# EAGLE schematic Maker Display4 (EAGLE 7.3.0), part 1 of 2

## Sheet 1 of 9: Matrix Driver 1
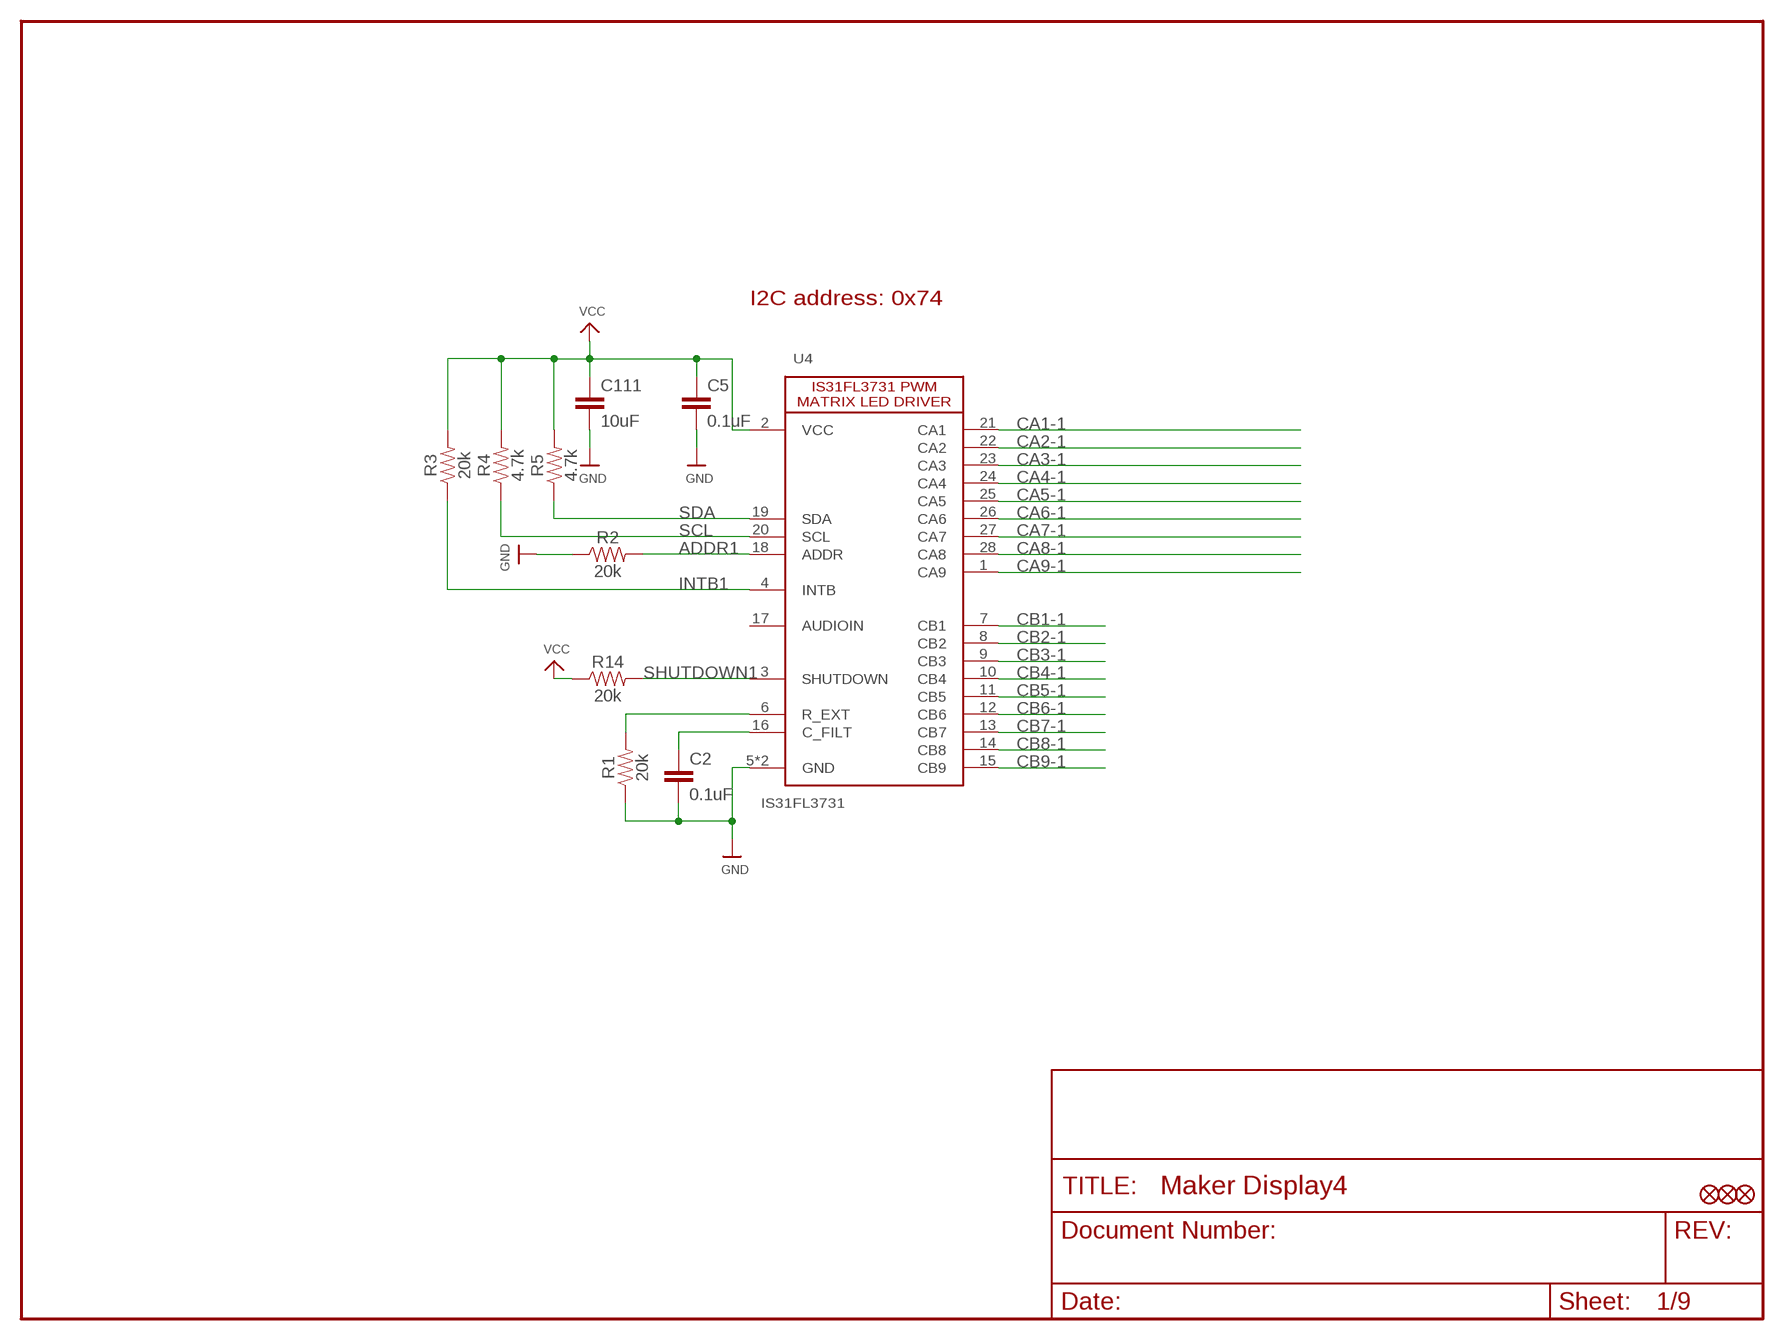
[diagram p0: schematic, sheet 1]

### Parts
C2  0.1uF  0.1UF-0603-25V-(+80/-20%)  [0603]
C5  0.1uF  0.1UF-0603-25V-(+80/-20%)  [0603]
C111  10uF  10UF-1206-6.3V-20%  [1206]
JP2  FIDUCIAL1X2  [FIDUCIAL-1X2]
JP3  FIDUCIAL1X2  [FIDUCIAL-1X2]
JP4  FIDUCIAL1X2  [FIDUCIAL-1X2]
R1  20k  20KOHM-0603-1/10W-1%  [0603]
R2  20k  20KOHM-0603-1/10W-1%  [0603]
R3  20k  20KOHM-0603-1/10W-1%  [0603]
R4  4.7k  4.7KOHM-0603-1/10W-1%  [0603]
R5  4.7k  4.7KOHM-0603-1/10W-1%  [0603]
R14  20k  20KOHM-0603-1/10W-1%  [0603]
U4  IS31FL3731  [QFN28]

### Nets
ADDR1: R2.2 U4.18(ADDR)
CA1-1: U4.21(CA1) ; also sheet 2
CA2-1: U4.22(CA2) ; also sheet 2
CA3-1: U4.23(CA3) ; also sheet 2
CA4-1: U4.24(CA4) ; also sheet 2
CA5-1: U4.25(CA5) ; also sheet 2
CA6-1: U4.26(CA6) ; also sheet 2
CA7-1: U4.27(CA7) ; also sheet 2
CA8-1: U4.28(CA8) ; also sheet 2
CA9-1: U4.1(CA9) ; also sheet 2
CB1-1: U4.7(CB1) ; also sheet 2
CB2-1: U4.8(CB2) ; also sheet 2
CB3-1: U4.9(CB3) ; also sheet 2
CB4-1: U4.10(CB4) ; also sheet 2
CB5-1: U4.11(CB5) ; also sheet 2
CB6-1: U4.12(CB6) ; also sheet 2
CB7-1: U4.13(CB7) ; also sheet 2
CB8-1: U4.14(CB8) ; also sheet 2
CB9-1: U4.15(CB9) ; also sheet 2
GND: C2.2 C5.2 C111.2 R1.1 R2.1 U4.5(GND) U4.29_GND(GND) ; also sheet 3,5,7,9
INTB1: R3.1 U4.4(INTB)
N$1: C2.1 U4.16(C_FILT)
N$2: R1.2 U4.6(R_EXT)
SCL: R4.1 U4.20(SCL) ; also sheet 3,5,7,9
SDA: R5.1 U4.19(SDA) ; also sheet 3,5,7,9
SHUTDOWN1: R14.2 U4.3(SHUTDOWN)
VCC: C5.1 C111.1 R3.2 R4.2 R5.2 R14.1 U4.2(VCC) ; also sheet 3,5,7,9
Unconnected: U4.17(AUDIOIN)

### Notes on the sheet
- I2C address: 0x74

## Sheet 2 of 9: LED matrix 1
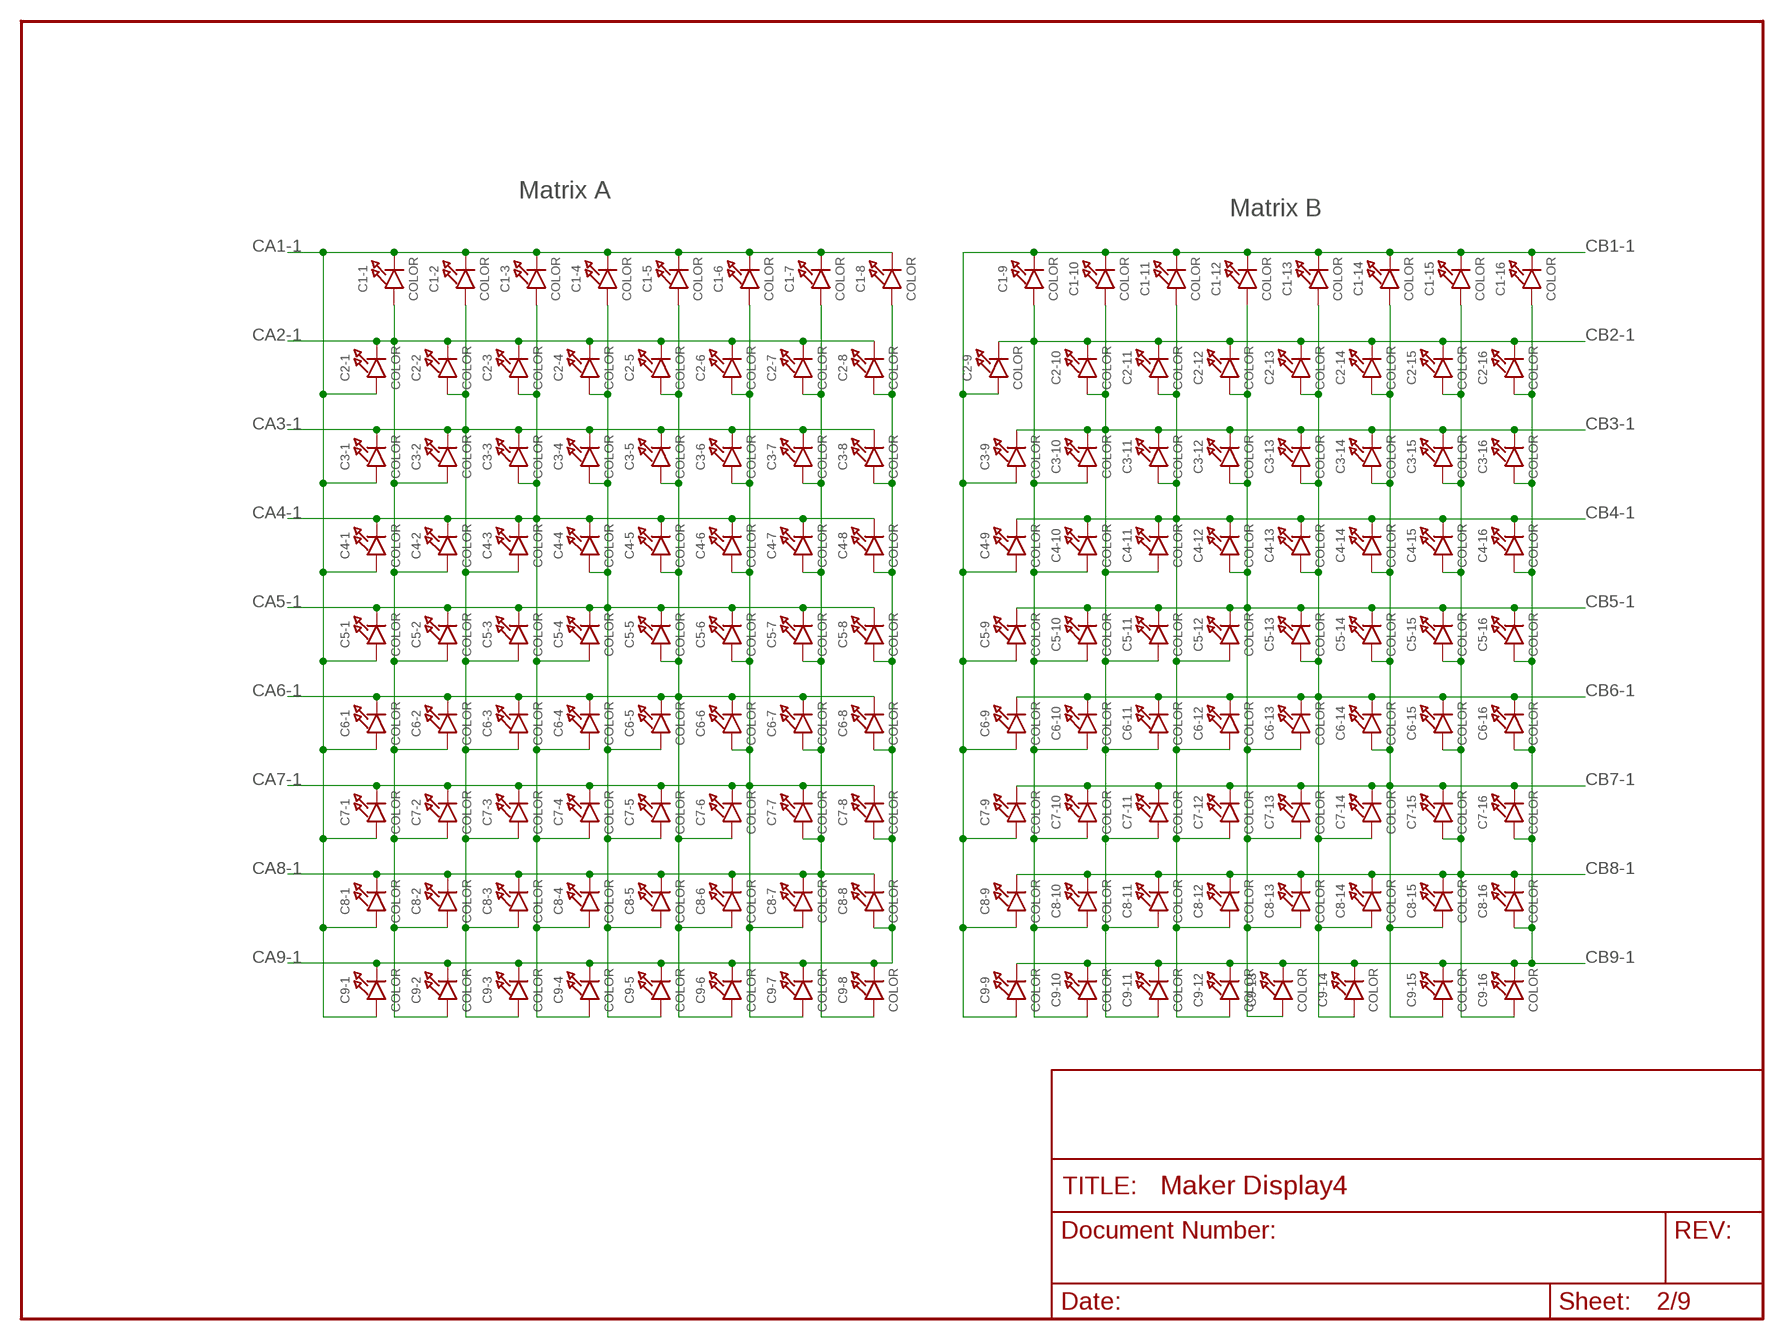
[diagram p1: schematic, sheet 2]

### Parts
C1-1  COLOR  LED0603_NOOUTLINE  [CHIPLED_0603_NOOUTLINE]
C1-2  COLOR  LED0603_NOOUTLINE  [CHIPLED_0603_NOOUTLINE]
C1-3  COLOR  LED0603_NOOUTLINE  [CHIPLED_0603_NOOUTLINE]
C1-4  COLOR  LED0603_NOOUTLINE  [CHIPLED_0603_NOOUTLINE]
C1-5  COLOR  LED0603_NOOUTLINE  [CHIPLED_0603_NOOUTLINE]
C1-6  COLOR  LED0603_NOOUTLINE  [CHIPLED_0603_NOOUTLINE]
C1-7  COLOR  LED0603_NOOUTLINE  [CHIPLED_0603_NOOUTLINE]
C1-8  COLOR  LED0603_NOOUTLINE  [CHIPLED_0603_NOOUTLINE]
C1-9  COLOR  LED0603_NOOUTLINE  [CHIPLED_0603_NOOUTLINE]
C1-10  COLOR  LED0603_NOOUTLINE  [CHIPLED_0603_NOOUTLINE]
C1-11  COLOR  LED0603_NOOUTLINE  [CHIPLED_0603_NOOUTLINE]
C1-12  COLOR  LED0603_NOOUTLINE  [CHIPLED_0603_NOOUTLINE]
C1-13  COLOR  LED0603_NOOUTLINE  [CHIPLED_0603_NOOUTLINE]
C1-14  COLOR  LED0603_NOOUTLINE  [CHIPLED_0603_NOOUTLINE]
C1-15  COLOR  LED0603_NOOUTLINE  [CHIPLED_0603_NOOUTLINE]
C1-16  COLOR  LED0603_NOOUTLINE  [CHIPLED_0603_NOOUTLINE]
C2-1  COLOR  LED0603_NOOUTLINE  [CHIPLED_0603_NOOUTLINE]
C2-2  COLOR  LED0603_NOOUTLINE  [CHIPLED_0603_NOOUTLINE]
C2-3  COLOR  LED0603_NOOUTLINE  [CHIPLED_0603_NOOUTLINE]
C2-4  COLOR  LED0603_NOOUTLINE  [CHIPLED_0603_NOOUTLINE]
C2-5  COLOR  LED0603_NOOUTLINE  [CHIPLED_0603_NOOUTLINE]
C2-6  COLOR  LED0603_NOOUTLINE  [CHIPLED_0603_NOOUTLINE]
C2-7  COLOR  LED0603_NOOUTLINE  [CHIPLED_0603_NOOUTLINE]
C2-8  COLOR  LED0603_NOOUTLINE  [CHIPLED_0603_NOOUTLINE]
C2-9  COLOR  LED0603_NOOUTLINE  [CHIPLED_0603_NOOUTLINE]
C2-10  COLOR  LED0603_NOOUTLINE  [CHIPLED_0603_NOOUTLINE]
C2-11  COLOR  LED0603_NOOUTLINE  [CHIPLED_0603_NOOUTLINE]
C2-12  COLOR  LED0603_NOOUTLINE  [CHIPLED_0603_NOOUTLINE]
C2-13  COLOR  LED0603_NOOUTLINE  [CHIPLED_0603_NOOUTLINE]
C2-14  COLOR  LED0603_NOOUTLINE  [CHIPLED_0603_NOOUTLINE]
C2-15  COLOR  LED0603_NOOUTLINE  [CHIPLED_0603_NOOUTLINE]
C2-16  COLOR  LED0603_NOOUTLINE  [CHIPLED_0603_NOOUTLINE]
C3-1  COLOR  LED0603_NOOUTLINE  [CHIPLED_0603_NOOUTLINE]
C3-2  COLOR  LED0603_NOOUTLINE  [CHIPLED_0603_NOOUTLINE]
C3-3  COLOR  LED0603_NOOUTLINE  [CHIPLED_0603_NOOUTLINE]
C3-4  COLOR  LED0603_NOOUTLINE  [CHIPLED_0603_NOOUTLINE]
C3-5  COLOR  LED0603_NOOUTLINE  [CHIPLED_0603_NOOUTLINE]
C3-6  COLOR  LED0603_NOOUTLINE  [CHIPLED_0603_NOOUTLINE]
C3-7  COLOR  LED0603_NOOUTLINE  [CHIPLED_0603_NOOUTLINE]
C3-8  COLOR  LED0603_NOOUTLINE  [CHIPLED_0603_NOOUTLINE]
C3-9  COLOR  LED0603_NOOUTLINE  [CHIPLED_0603_NOOUTLINE]
C3-10  COLOR  LED0603_NOOUTLINE  [CHIPLED_0603_NOOUTLINE]
C3-11  COLOR  LED0603_NOOUTLINE  [CHIPLED_0603_NOOUTLINE]
C3-12  COLOR  LED0603_NOOUTLINE  [CHIPLED_0603_NOOUTLINE]
C3-13  COLOR  LED0603_NOOUTLINE  [CHIPLED_0603_NOOUTLINE]
C3-14  COLOR  LED0603_NOOUTLINE  [CHIPLED_0603_NOOUTLINE]
C3-15  COLOR  LED0603_NOOUTLINE  [CHIPLED_0603_NOOUTLINE]
C3-16  COLOR  LED0603_NOOUTLINE  [CHIPLED_0603_NOOUTLINE]
C4-1  COLOR  LED0603_NOOUTLINE  [CHIPLED_0603_NOOUTLINE]
C4-2  COLOR  LED0603_NOOUTLINE  [CHIPLED_0603_NOOUTLINE]
C4-3  COLOR  LED0603_NOOUTLINE  [CHIPLED_0603_NOOUTLINE]
C4-4  COLOR  LED0603_NOOUTLINE  [CHIPLED_0603_NOOUTLINE]
C4-5  COLOR  LED0603_NOOUTLINE  [CHIPLED_0603_NOOUTLINE]
C4-6  COLOR  LED0603_NOOUTLINE  [CHIPLED_0603_NOOUTLINE]
C4-7  COLOR  LED0603_NOOUTLINE  [CHIPLED_0603_NOOUTLINE]
C4-8  COLOR  LED0603_NOOUTLINE  [CHIPLED_0603_NOOUTLINE]
C4-9  COLOR  LED0603_NOOUTLINE  [CHIPLED_0603_NOOUTLINE]
C4-10  COLOR  LED0603_NOOUTLINE  [CHIPLED_0603_NOOUTLINE]
C4-11  COLOR  LED0603_NOOUTLINE  [CHIPLED_0603_NOOUTLINE]
C4-12  COLOR  LED0603_NOOUTLINE  [CHIPLED_0603_NOOUTLINE]
C4-13  COLOR  LED0603_NOOUTLINE  [CHIPLED_0603_NOOUTLINE]
C4-14  COLOR  LED0603_NOOUTLINE  [CHIPLED_0603_NOOUTLINE]
C4-15  COLOR  LED0603_NOOUTLINE  [CHIPLED_0603_NOOUTLINE]
C4-16  COLOR  LED0603_NOOUTLINE  [CHIPLED_0603_NOOUTLINE]
C5-1  COLOR  LED0603_NOOUTLINE  [CHIPLED_0603_NOOUTLINE]
C5-2  COLOR  LED0603_NOOUTLINE  [CHIPLED_0603_NOOUTLINE]
C5-3  COLOR  LED0603_NOOUTLINE  [CHIPLED_0603_NOOUTLINE]
C5-4  COLOR  LED0603_NOOUTLINE  [CHIPLED_0603_NOOUTLINE]
C5-5  COLOR  LED0603_NOOUTLINE  [CHIPLED_0603_NOOUTLINE]
C5-6  COLOR  LED0603_NOOUTLINE  [CHIPLED_0603_NOOUTLINE]
C5-7  COLOR  LED0603_NOOUTLINE  [CHIPLED_0603_NOOUTLINE]
C5-8  COLOR  LED0603_NOOUTLINE  [CHIPLED_0603_NOOUTLINE]
C5-9  COLOR  LED0603_NOOUTLINE  [CHIPLED_0603_NOOUTLINE]
C5-10  COLOR  LED0603_NOOUTLINE  [CHIPLED_0603_NOOUTLINE]
C5-11  COLOR  LED0603_NOOUTLINE  [CHIPLED_0603_NOOUTLINE]
C5-12  COLOR  LED0603_NOOUTLINE  [CHIPLED_0603_NOOUTLINE]
C5-13  COLOR  LED0603_NOOUTLINE  [CHIPLED_0603_NOOUTLINE]
C5-14  COLOR  LED0603_NOOUTLINE  [CHIPLED_0603_NOOUTLINE]
C5-15  COLOR  LED0603_NOOUTLINE  [CHIPLED_0603_NOOUTLINE]
C5-16  COLOR  LED0603_NOOUTLINE  [CHIPLED_0603_NOOUTLINE]
C6-1  COLOR  LED0603_NOOUTLINE  [CHIPLED_0603_NOOUTLINE]
C6-2  COLOR  LED0603_NOOUTLINE  [CHIPLED_0603_NOOUTLINE]
C6-3  COLOR  LED0603_NOOUTLINE  [CHIPLED_0603_NOOUTLINE]
C6-4  COLOR  LED0603_NOOUTLINE  [CHIPLED_0603_NOOUTLINE]
C6-5  COLOR  LED0603_NOOUTLINE  [CHIPLED_0603_NOOUTLINE]
C6-6  COLOR  LED0603_NOOUTLINE  [CHIPLED_0603_NOOUTLINE]
C6-7  COLOR  LED0603_NOOUTLINE  [CHIPLED_0603_NOOUTLINE]
C6-8  COLOR  LED0603_NOOUTLINE  [CHIPLED_0603_NOOUTLINE]
C6-9  COLOR  LED0603_NOOUTLINE  [CHIPLED_0603_NOOUTLINE]
C6-10  COLOR  LED0603_NOOUTLINE  [CHIPLED_0603_NOOUTLINE]
C6-11  COLOR  LED0603_NOOUTLINE  [CHIPLED_0603_NOOUTLINE]
C6-12  COLOR  LED0603_NOOUTLINE  [CHIPLED_0603_NOOUTLINE]
C6-13  COLOR  LED0603_NOOUTLINE  [CHIPLED_0603_NOOUTLINE]
C6-14  COLOR  LED0603_NOOUTLINE  [CHIPLED_0603_NOOUTLINE]
C6-15  COLOR  LED0603_NOOUTLINE  [CHIPLED_0603_NOOUTLINE]
C6-16  COLOR  LED0603_NOOUTLINE  [CHIPLED_0603_NOOUTLINE]
C7-1  COLOR  LED0603_NOOUTLINE  [CHIPLED_0603_NOOUTLINE]
C7-2  COLOR  LED0603_NOOUTLINE  [CHIPLED_0603_NOOUTLINE]
C7-3  COLOR  LED0603_NOOUTLINE  [CHIPLED_0603_NOOUTLINE]
C7-4  COLOR  LED0603_NOOUTLINE  [CHIPLED_0603_NOOUTLINE]
C7-5  COLOR  LED0603_NOOUTLINE  [CHIPLED_0603_NOOUTLINE]
C7-6  COLOR  LED0603_NOOUTLINE  [CHIPLED_0603_NOOUTLINE]
C7-7  COLOR  LED0603_NOOUTLINE  [CHIPLED_0603_NOOUTLINE]
C7-8  COLOR  LED0603_NOOUTLINE  [CHIPLED_0603_NOOUTLINE]
C7-9  COLOR  LED0603_NOOUTLINE  [CHIPLED_0603_NOOUTLINE]
C7-10  COLOR  LED0603_NOOUTLINE  [CHIPLED_0603_NOOUTLINE]
C7-11  COLOR  LED0603_NOOUTLINE  [CHIPLED_0603_NOOUTLINE]
C7-12  COLOR  LED0603_NOOUTLINE  [CHIPLED_0603_NOOUTLINE]
C7-13  COLOR  LED0603_NOOUTLINE  [CHIPLED_0603_NOOUTLINE]
C7-14  COLOR  LED0603_NOOUTLINE  [CHIPLED_0603_NOOUTLINE]
C7-15  COLOR  LED0603_NOOUTLINE  [CHIPLED_0603_NOOUTLINE]
C7-16  COLOR  LED0603_NOOUTLINE  [CHIPLED_0603_NOOUTLINE]
C8-1  COLOR  LED0603_NOOUTLINE  [CHIPLED_0603_NOOUTLINE]
C8-2  COLOR  LED0603_NOOUTLINE  [CHIPLED_0603_NOOUTLINE]
C8-3  COLOR  LED0603_NOOUTLINE  [CHIPLED_0603_NOOUTLINE]
C8-4  COLOR  LED0603_NOOUTLINE  [CHIPLED_0603_NOOUTLINE]
C8-5  COLOR  LED0603_NOOUTLINE  [CHIPLED_0603_NOOUTLINE]
C8-6  COLOR  LED0603_NOOUTLINE  [CHIPLED_0603_NOOUTLINE]
C8-7  COLOR  LED0603_NOOUTLINE  [CHIPLED_0603_NOOUTLINE]
C8-8  COLOR  LED0603_NOOUTLINE  [CHIPLED_0603_NOOUTLINE]
C8-9  COLOR  LED0603_NOOUTLINE  [CHIPLED_0603_NOOUTLINE]
C8-10  COLOR  LED0603_NOOUTLINE  [CHIPLED_0603_NOOUTLINE]
C8-11  COLOR  LED0603_NOOUTLINE  [CHIPLED_0603_NOOUTLINE]
C8-12  COLOR  LED0603_NOOUTLINE  [CHIPLED_0603_NOOUTLINE]
C8-13  COLOR  LED0603_NOOUTLINE  [CHIPLED_0603_NOOUTLINE]
C8-14  COLOR  LED0603_NOOUTLINE  [CHIPLED_0603_NOOUTLINE]
C8-15  COLOR  LED0603_NOOUTLINE  [CHIPLED_0603_NOOUTLINE]
C8-16  COLOR  LED0603_NOOUTLINE  [CHIPLED_0603_NOOUTLINE]
C9-1  COLOR  LED0603_NOOUTLINE  [CHIPLED_0603_NOOUTLINE]
C9-2  COLOR  LED0603_NOOUTLINE  [CHIPLED_0603_NOOUTLINE]
C9-3  COLOR  LED0603_NOOUTLINE  [CHIPLED_0603_NOOUTLINE]
C9-4  COLOR  LED0603_NOOUTLINE  [CHIPLED_0603_NOOUTLINE]
C9-5  COLOR  LED0603_NOOUTLINE  [CHIPLED_0603_NOOUTLINE]
C9-6  COLOR  LED0603_NOOUTLINE  [CHIPLED_0603_NOOUTLINE]
C9-7  COLOR  LED0603_NOOUTLINE  [CHIPLED_0603_NOOUTLINE]
C9-8  COLOR  LED0603_NOOUTLINE  [CHIPLED_0603_NOOUTLINE]
C9-9  COLOR  LED0603_NOOUTLINE  [CHIPLED_0603_NOOUTLINE]
C9-10  COLOR  LED0603_NOOUTLINE  [CHIPLED_0603_NOOUTLINE]
C9-11  COLOR  LED0603_NOOUTLINE  [CHIPLED_0603_NOOUTLINE]
C9-12  COLOR  LED0603_NOOUTLINE  [CHIPLED_0603_NOOUTLINE]
C9-13  COLOR  LED0603_NOOUTLINE  [CHIPLED_0603_NOOUTLINE]
C9-14  COLOR  LED0603_NOOUTLINE  [CHIPLED_0603_NOOUTLINE]
C9-15  COLOR  LED0603_NOOUTLINE  [CHIPLED_0603_NOOUTLINE]
C9-16  COLOR  LED0603_NOOUTLINE  [CHIPLED_0603_NOOUTLINE]

### Nets
CA1-1: C1-1.C C1-2.C C1-3.C C1-4.C C1-5.C C1-6.C C1-7.C C1-8.C C2-1.A C3-1.A C4-1.A C5-1.A C6-1.A C7-1.A C8-1.A C9-1.A ; also sheet 1
CA2-1: C1-1.A C2-1.C C2-2.C C2-3.C C2-4.C C2-5.C C2-6.C C2-7.C C2-8.C C3-2.A C4-2.A C5-2.A C6-2.A C7-2.A C8-2.A C9-2.A ; also sheet 1
CA3-1: C1-2.A C2-2.A C3-1.C C3-2.C C3-3.C C3-4.C C3-5.C C3-6.C C3-7.C C3-8.C C4-3.A C5-3.A C6-3.A C7-3.A C8-3.A C9-3.A ; also sheet 1
CA4-1: C1-3.A C2-3.A C3-3.A C4-1.C C4-2.C C4-3.C C4-4.C C4-5.C C4-6.C C4-7.C C4-8.C C5-4.A C6-4.A C7-4.A C8-4.A C9-4.A ; also sheet 1
CA5-1: C1-4.A C2-4.A C3-4.A C4-4.A C5-1.C C5-2.C C5-3.C C5-4.C C5-5.C C5-6.C C5-7.C C5-8.C C6-5.A C7-5.A C8-5.A C9-5.A ; also sheet 1
CA6-1: C1-5.A C2-5.A C3-5.A C4-5.A C5-5.A C6-1.C C6-2.C C6-3.C C6-4.C C6-5.C C6-6.C C6-7.C C6-8.C C7-6.A C8-6.A C9-6.A ; also sheet 1
CA7-1: C1-6.A C2-6.A C3-6.A C4-6.A C5-6.A C6-6.A C7-1.C C7-2.C C7-3.C C7-4.C C7-5.C C7-6.C C7-7.C C7-8.C C8-7.A C9-7.A ; also sheet 1
CA8-1: C1-7.A C2-7.A C3-7.A C4-7.A C5-7.A C6-7.A C7-7.A C8-1.C C8-2.C C8-3.C C8-4.C C8-5.C C8-6.C C8-7.C C8-8.C C9-8.A ; also sheet 1
CA9-1: C1-8.A C2-8.A C3-8.A C4-8.A C5-8.A C6-8.A C7-8.A C8-8.A C9-1.C C9-2.C C9-3.C C9-4.C C9-5.C C9-6.C C9-7.C C9-8.C ; also sheet 1
CB1-1: C1-9.C C1-10.C C1-11.C C1-12.C C1-13.C C1-14.C C1-15.C C1-16.C C2-9.A C3-9.A C4-9.A C5-9.A C6-9.A C7-9.A C8-9.A C9-9.A ; also sheet 1
CB2-1: C1-9.A C2-9.C C2-10.C C2-11.C C2-12.C C2-13.C C2-14.C C2-15.C C2-16.C C3-10.A C4-10.A C5-10.A C6-10.A C7-10.A C8-10.A C9-10.A ; also sheet 1
CB3-1: C1-10.A C2-10.A C3-9.C C3-10.C C3-11.C C3-12.C C3-13.C C3-14.C C3-15.C C3-16.C C4-11.A C5-11.A C6-11.A C7-11.A C8-11.A C9-11.A ; also sheet 1
CB4-1: C1-11.A C2-11.A C3-11.A C4-9.C C4-10.C C4-11.C C4-12.C C4-13.C C4-14.C C4-15.C C4-16.C C5-12.A C6-12.A C7-12.A C8-12.A C9-12.A ; also sheet 1
CB5-1: C1-12.A C2-12.A C3-12.A C4-12.A C5-9.C C5-10.C C5-11.C C5-12.C C5-13.C C5-14.C C5-15.C C5-16.C C6-13.A C7-13.A C8-13.A C9-13.A ; also sheet 1
CB6-1: C1-13.A C2-13.A C3-13.A C4-13.A C5-13.A C6-9.C C6-10.C C6-11.C C6-12.C C6-13.C C6-14.C C6-15.C C6-16.C C7-14.A C8-14.A C9-14.A ; also sheet 1
CB7-1: C1-14.A C2-14.A C3-14.A C4-14.A C5-14.A C6-14.A C7-9.C C7-10.C C7-11.C C7-12.C C7-13.C C7-14.C C7-15.C C7-16.C C8-15.A C9-15.A ; also sheet 1
CB8-1: C1-15.A C2-15.A C3-15.A C4-15.A C5-15.A C6-15.A C7-15.A C8-9.C C8-10.C C8-11.C C8-12.C C8-13.C C8-14.C C8-15.C C8-16.C C9-16.A ; also sheet 1
CB9-1: C1-16.A C2-16.A C3-16.A C4-16.A C5-16.A C6-16.A C7-16.A C8-16.A C9-9.C C9-10.C C9-11.C C9-12.C C9-13.C C9-14.C C9-15.C C9-16.C ; also sheet 1

### Notes on the sheet
- Matrix A
- Matrix B

## Sheet 3 of 9: Matrix Driver 2
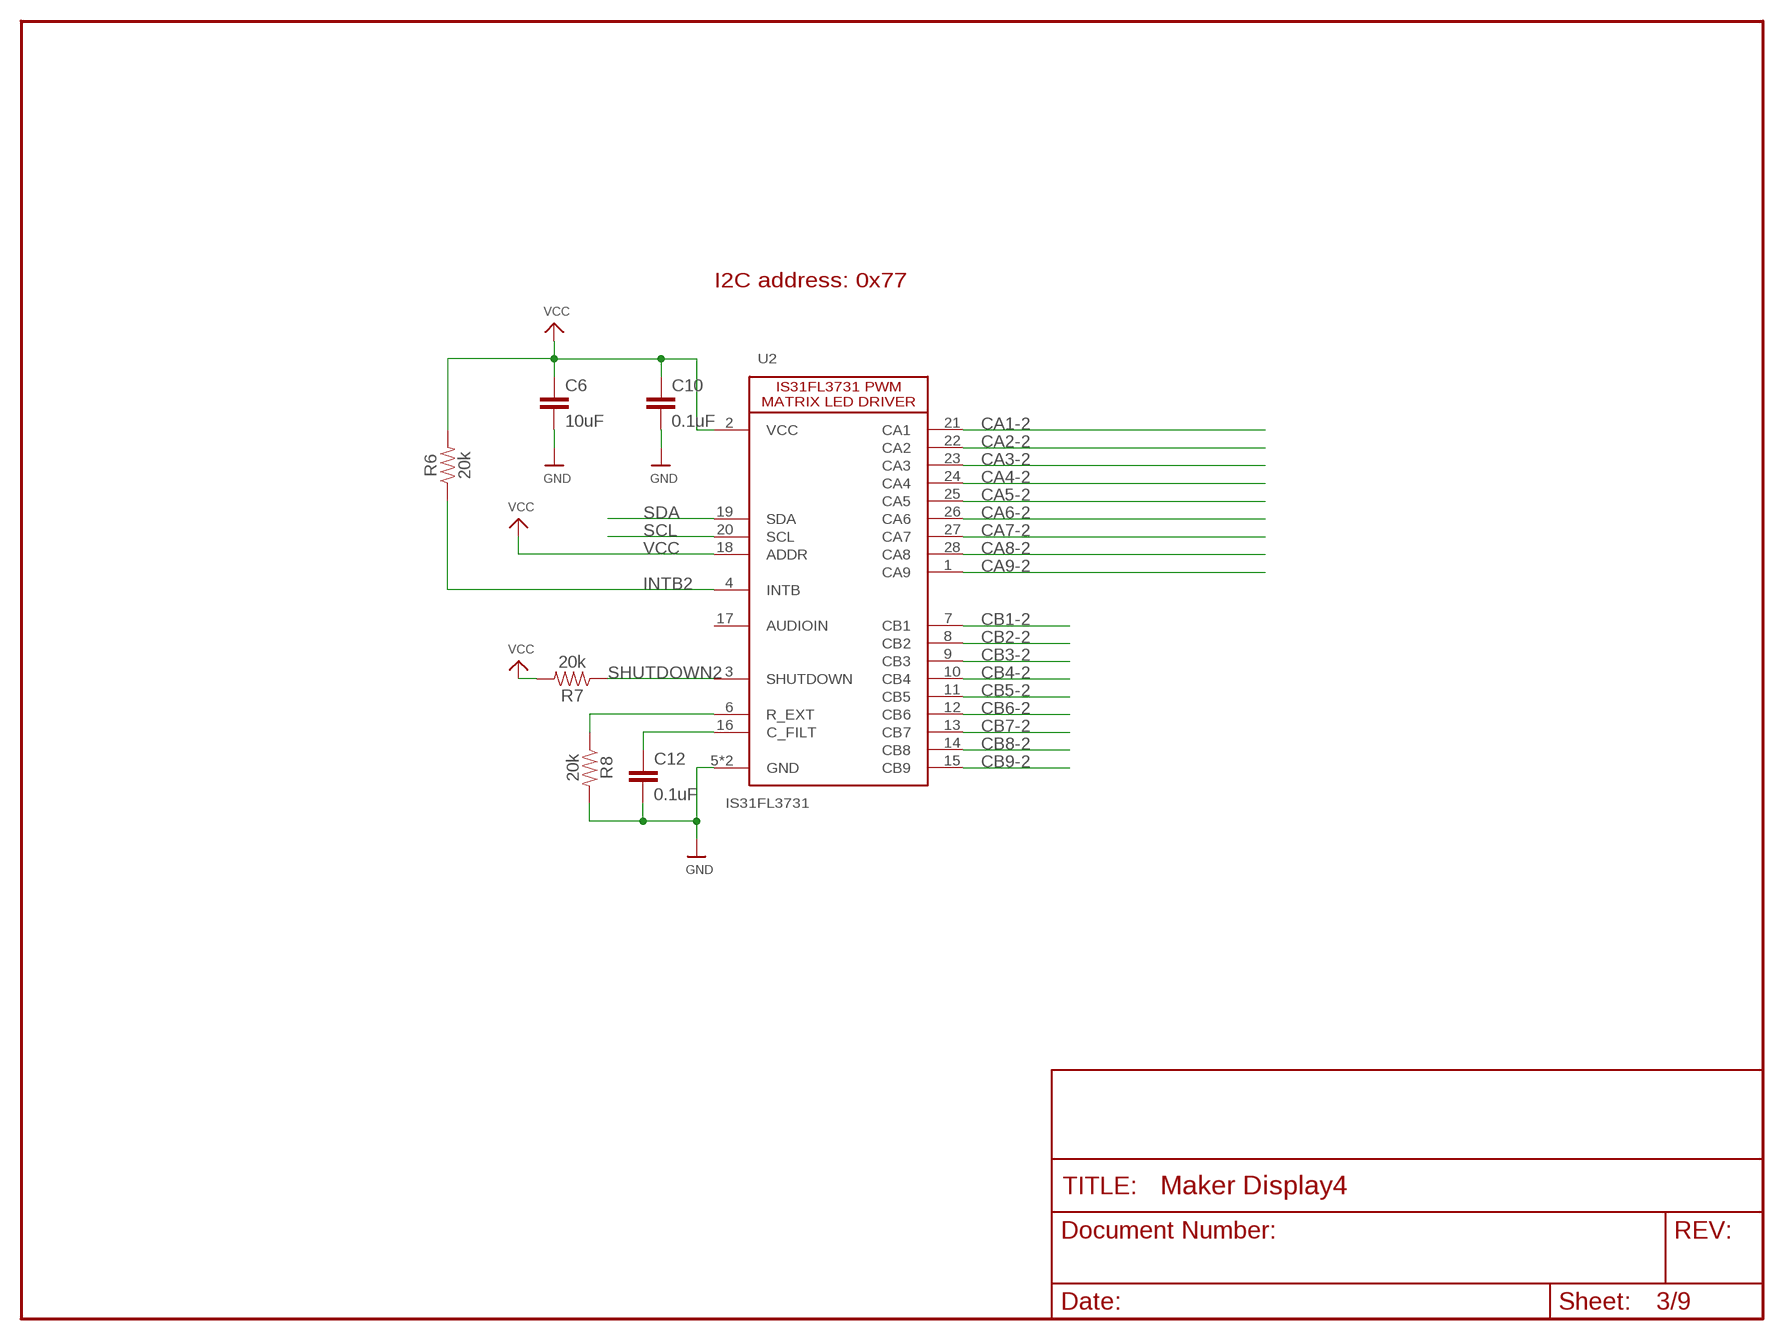
[diagram p2: schematic, sheet 3]

### Parts
C6  10uF  10UF-1206-6.3V-20%  [1206]
C10  0.1uF  0.1UF-0603-25V-(+80/-20%)  [0603]
C12  0.1uF  0.1UF-0603-25V-(+80/-20%)  [0603]
R6  20k  20KOHM-0603-1/10W-1%  [0603]
R7  20k  20KOHM-0603-1/10W-1%  [0603]
R8  20k  20KOHM-0603-1/10W-1%  [0603]
U2  IS31FL3731  [QFN28]

### Nets
CA1-2: U2.21(CA1) ; also sheet 4
CA2-2: U2.22(CA2) ; also sheet 4
CA3-2: U2.23(CA3) ; also sheet 4
CA4-2: U2.24(CA4) ; also sheet 4
CA5-2: U2.25(CA5) ; also sheet 4
CA6-2: U2.26(CA6) ; also sheet 4
CA7-2: U2.27(CA7) ; also sheet 4
CA8-2: U2.28(CA8) ; also sheet 4
CA9-2: U2.1(CA9) ; also sheet 4
CB1-2: U2.7(CB1) ; also sheet 4
CB2-2: U2.8(CB2) ; also sheet 4
CB3-2: U2.9(CB3) ; also sheet 4
CB4-2: U2.10(CB4) ; also sheet 4
CB5-2: U2.11(CB5) ; also sheet 4
CB6-2: U2.12(CB6) ; also sheet 4
CB7-2: U2.13(CB7) ; also sheet 4
CB8-2: U2.14(CB8) ; also sheet 4
CB9-2: U2.15(CB9) ; also sheet 4
GND: C6.2 C10.2 C12.2 R8.2 U2.5(GND) U2.29_GND(GND) ; also sheet 1,5,7,9
INTB2: R6.1 U2.4(INTB)
N$4: C12.1 U2.16(C_FILT)
N$5: R8.1 U2.6(R_EXT)
SCL: U2.20(SCL) ; also sheet 1,5,7,9
SDA: U2.19(SDA) ; also sheet 1,5,7,9
SHUTDOWN2: R7.1 U2.3(SHUTDOWN)
VCC: C6.1 C10.1 R6.2 R7.2 U2.2(VCC) U2.18(ADDR) ; also sheet 1,5,7,9
Unconnected: U2.17(AUDIOIN)

### Notes on the sheet
- I2C address: 0x77

## Sheet 4 of 9: LED Matrix 2
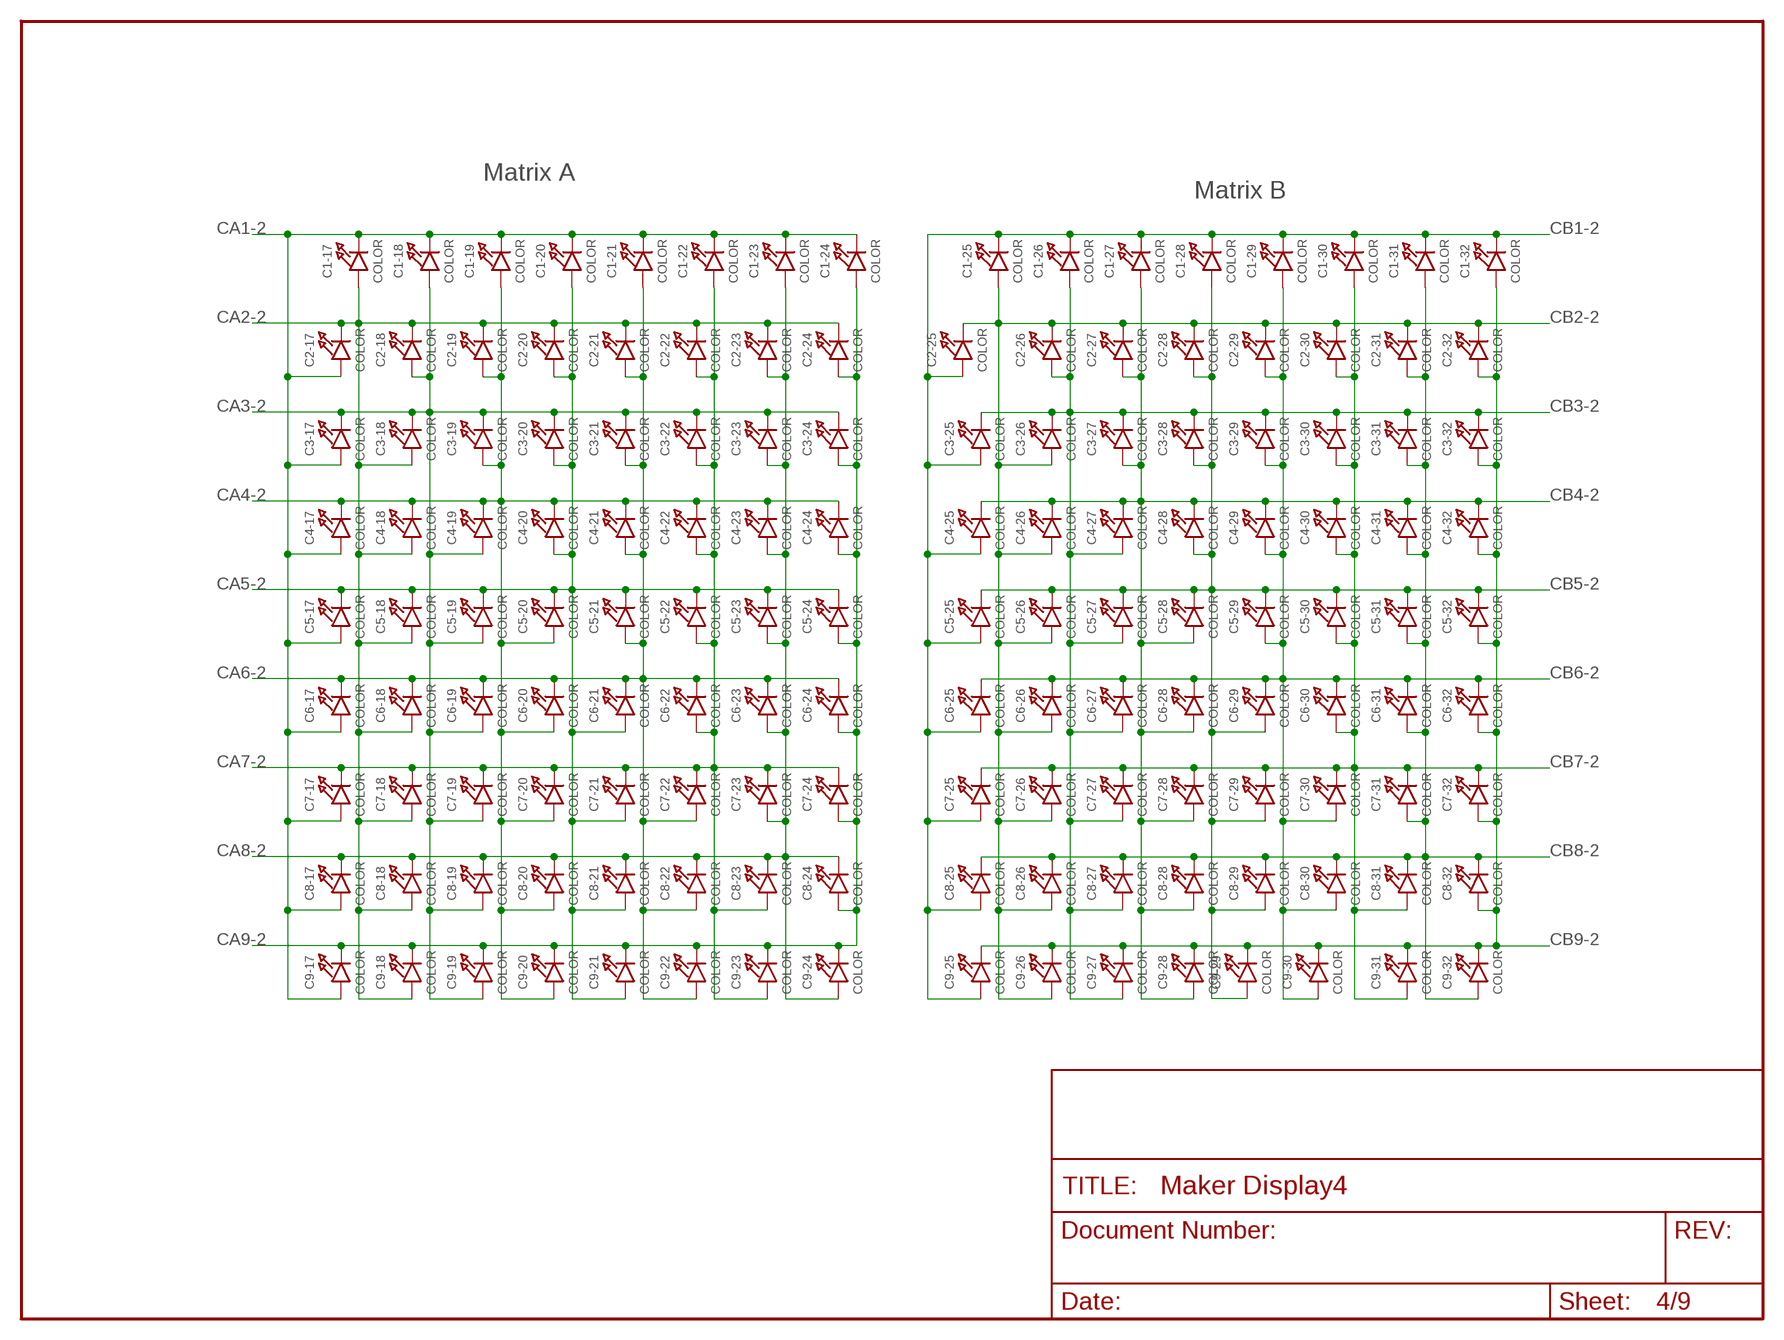
[diagram p3: schematic, sheet 4]

### Parts
C1-17  COLOR  LED0603_NOOUTLINE  [CHIPLED_0603_NOOUTLINE]
C1-18  COLOR  LED0603_NOOUTLINE  [CHIPLED_0603_NOOUTLINE]
C1-19  COLOR  LED0603_NOOUTLINE  [CHIPLED_0603_NOOUTLINE]
C1-20  COLOR  LED0603_NOOUTLINE  [CHIPLED_0603_NOOUTLINE]
C1-21  COLOR  LED0603_NOOUTLINE  [CHIPLED_0603_NOOUTLINE]
C1-22  COLOR  LED0603_NOOUTLINE  [CHIPLED_0603_NOOUTLINE]
C1-23  COLOR  LED0603_NOOUTLINE  [CHIPLED_0603_NOOUTLINE]
C1-24  COLOR  LED0603_NOOUTLINE  [CHIPLED_0603_NOOUTLINE]
C1-25  COLOR  LED0603_NOOUTLINE  [CHIPLED_0603_NOOUTLINE]
C1-26  COLOR  LED0603_NOOUTLINE  [CHIPLED_0603_NOOUTLINE]
C1-27  COLOR  LED0603_NOOUTLINE  [CHIPLED_0603_NOOUTLINE]
C1-28  COLOR  LED0603_NOOUTLINE  [CHIPLED_0603_NOOUTLINE]
C1-29  COLOR  LED0603_NOOUTLINE  [CHIPLED_0603_NOOUTLINE]
C1-30  COLOR  LED0603_NOOUTLINE  [CHIPLED_0603_NOOUTLINE]
C1-31  COLOR  LED0603_NOOUTLINE  [CHIPLED_0603_NOOUTLINE]
C1-32  COLOR  LED0603_NOOUTLINE  [CHIPLED_0603_NOOUTLINE]
C2-17  COLOR  LED0603_NOOUTLINE  [CHIPLED_0603_NOOUTLINE]
C2-18  COLOR  LED0603_NOOUTLINE  [CHIPLED_0603_NOOUTLINE]
C2-19  COLOR  LED0603_NOOUTLINE  [CHIPLED_0603_NOOUTLINE]
C2-20  COLOR  LED0603_NOOUTLINE  [CHIPLED_0603_NOOUTLINE]
C2-21  COLOR  LED0603_NOOUTLINE  [CHIPLED_0603_NOOUTLINE]
C2-22  COLOR  LED0603_NOOUTLINE  [CHIPLED_0603_NOOUTLINE]
C2-23  COLOR  LED0603_NOOUTLINE  [CHIPLED_0603_NOOUTLINE]
C2-24  COLOR  LED0603_NOOUTLINE  [CHIPLED_0603_NOOUTLINE]
C2-25  COLOR  LED0603_NOOUTLINE  [CHIPLED_0603_NOOUTLINE]
C2-26  COLOR  LED0603_NOOUTLINE  [CHIPLED_0603_NOOUTLINE]
C2-27  COLOR  LED0603_NOOUTLINE  [CHIPLED_0603_NOOUTLINE]
C2-28  COLOR  LED0603_NOOUTLINE  [CHIPLED_0603_NOOUTLINE]
C2-29  COLOR  LED0603_NOOUTLINE  [CHIPLED_0603_NOOUTLINE]
C2-30  COLOR  LED0603_NOOUTLINE  [CHIPLED_0603_NOOUTLINE]
C2-31  COLOR  LED0603_NOOUTLINE  [CHIPLED_0603_NOOUTLINE]
C2-32  COLOR  LED0603_NOOUTLINE  [CHIPLED_0603_NOOUTLINE]
C3-17  COLOR  LED0603_NOOUTLINE  [CHIPLED_0603_NOOUTLINE]
C3-18  COLOR  LED0603_NOOUTLINE  [CHIPLED_0603_NOOUTLINE]
C3-19  COLOR  LED0603_NOOUTLINE  [CHIPLED_0603_NOOUTLINE]
C3-20  COLOR  LED0603_NOOUTLINE  [CHIPLED_0603_NOOUTLINE]
C3-21  COLOR  LED0603_NOOUTLINE  [CHIPLED_0603_NOOUTLINE]
C3-22  COLOR  LED0603_NOOUTLINE  [CHIPLED_0603_NOOUTLINE]
C3-23  COLOR  LED0603_NOOUTLINE  [CHIPLED_0603_NOOUTLINE]
C3-24  COLOR  LED0603_NOOUTLINE  [CHIPLED_0603_NOOUTLINE]
C3-25  COLOR  LED0603_NOOUTLINE  [CHIPLED_0603_NOOUTLINE]
C3-26  COLOR  LED0603_NOOUTLINE  [CHIPLED_0603_NOOUTLINE]
C3-27  COLOR  LED0603_NOOUTLINE  [CHIPLED_0603_NOOUTLINE]
C3-28  COLOR  LED0603_NOOUTLINE  [CHIPLED_0603_NOOUTLINE]
C3-29  COLOR  LED0603_NOOUTLINE  [CHIPLED_0603_NOOUTLINE]
C3-30  COLOR  LED0603_NOOUTLINE  [CHIPLED_0603_NOOUTLINE]
C3-31  COLOR  LED0603_NOOUTLINE  [CHIPLED_0603_NOOUTLINE]
C3-32  COLOR  LED0603_NOOUTLINE  [CHIPLED_0603_NOOUTLINE]
C4-17  COLOR  LED0603_NOOUTLINE  [CHIPLED_0603_NOOUTLINE]
C4-18  COLOR  LED0603_NOOUTLINE  [CHIPLED_0603_NOOUTLINE]
C4-19  COLOR  LED0603_NOOUTLINE  [CHIPLED_0603_NOOUTLINE]
C4-20  COLOR  LED0603_NOOUTLINE  [CHIPLED_0603_NOOUTLINE]
C4-21  COLOR  LED0603_NOOUTLINE  [CHIPLED_0603_NOOUTLINE]
C4-22  COLOR  LED0603_NOOUTLINE  [CHIPLED_0603_NOOUTLINE]
C4-23  COLOR  LED0603_NOOUTLINE  [CHIPLED_0603_NOOUTLINE]
C4-24  COLOR  LED0603_NOOUTLINE  [CHIPLED_0603_NOOUTLINE]
C4-25  COLOR  LED0603_NOOUTLINE  [CHIPLED_0603_NOOUTLINE]
C4-26  COLOR  LED0603_NOOUTLINE  [CHIPLED_0603_NOOUTLINE]
C4-27  COLOR  LED0603_NOOUTLINE  [CHIPLED_0603_NOOUTLINE]
C4-28  COLOR  LED0603_NOOUTLINE  [CHIPLED_0603_NOOUTLINE]
C4-29  COLOR  LED0603_NOOUTLINE  [CHIPLED_0603_NOOUTLINE]
C4-30  COLOR  LED0603_NOOUTLINE  [CHIPLED_0603_NOOUTLINE]
C4-31  COLOR  LED0603_NOOUTLINE  [CHIPLED_0603_NOOUTLINE]
C4-32  COLOR  LED0603_NOOUTLINE  [CHIPLED_0603_NOOUTLINE]
C5-17  COLOR  LED0603_NOOUTLINE  [CHIPLED_0603_NOOUTLINE]
C5-18  COLOR  LED0603_NOOUTLINE  [CHIPLED_0603_NOOUTLINE]
C5-19  COLOR  LED0603_NOOUTLINE  [CHIPLED_0603_NOOUTLINE]
C5-20  COLOR  LED0603_NOOUTLINE  [CHIPLED_0603_NOOUTLINE]
C5-21  COLOR  LED0603_NOOUTLINE  [CHIPLED_0603_NOOUTLINE]
C5-22  COLOR  LED0603_NOOUTLINE  [CHIPLED_0603_NOOUTLINE]
C5-23  COLOR  LED0603_NOOUTLINE  [CHIPLED_0603_NOOUTLINE]
C5-24  COLOR  LED0603_NOOUTLINE  [CHIPLED_0603_NOOUTLINE]
C5-25  COLOR  LED0603_NOOUTLINE  [CHIPLED_0603_NOOUTLINE]
C5-26  COLOR  LED0603_NOOUTLINE  [CHIPLED_0603_NOOUTLINE]
C5-27  COLOR  LED0603_NOOUTLINE  [CHIPLED_0603_NOOUTLINE]
C5-28  COLOR  LED0603_NOOUTLINE  [CHIPLED_0603_NOOUTLINE]
C5-29  COLOR  LED0603_NOOUTLINE  [CHIPLED_0603_NOOUTLINE]
C5-30  COLOR  LED0603_NOOUTLINE  [CHIPLED_0603_NOOUTLINE]
C5-31  COLOR  LED0603_NOOUTLINE  [CHIPLED_0603_NOOUTLINE]
C5-32  COLOR  LED0603_NOOUTLINE  [CHIPLED_0603_NOOUTLINE]
C6-17  COLOR  LED0603_NOOUTLINE  [CHIPLED_0603_NOOUTLINE]
C6-18  COLOR  LED0603_NOOUTLINE  [CHIPLED_0603_NOOUTLINE]
C6-19  COLOR  LED0603_NOOUTLINE  [CHIPLED_0603_NOOUTLINE]
C6-20  COLOR  LED0603_NOOUTLINE  [CHIPLED_0603_NOOUTLINE]
C6-21  COLOR  LED0603_NOOUTLINE  [CHIPLED_0603_NOOUTLINE]
C6-22  COLOR  LED0603_NOOUTLINE  [CHIPLED_0603_NOOUTLINE]
C6-23  COLOR  LED0603_NOOUTLINE  [CHIPLED_0603_NOOUTLINE]
C6-24  COLOR  LED0603_NOOUTLINE  [CHIPLED_0603_NOOUTLINE]
C6-25  COLOR  LED0603_NOOUTLINE  [CHIPLED_0603_NOOUTLINE]
C6-26  COLOR  LED0603_NOOUTLINE  [CHIPLED_0603_NOOUTLINE]
C6-27  COLOR  LED0603_NOOUTLINE  [CHIPLED_0603_NOOUTLINE]
C6-28  COLOR  LED0603_NOOUTLINE  [CHIPLED_0603_NOOUTLINE]
C6-29  COLOR  LED0603_NOOUTLINE  [CHIPLED_0603_NOOUTLINE]
C6-30  COLOR  LED0603_NOOUTLINE  [CHIPLED_0603_NOOUTLINE]
C6-31  COLOR  LED0603_NOOUTLINE  [CHIPLED_0603_NOOUTLINE]
C6-32  COLOR  LED0603_NOOUTLINE  [CHIPLED_0603_NOOUTLINE]
C7-17  COLOR  LED0603_NOOUTLINE  [CHIPLED_0603_NOOUTLINE]
C7-18  COLOR  LED0603_NOOUTLINE  [CHIPLED_0603_NOOUTLINE]
C7-19  COLOR  LED0603_NOOUTLINE  [CHIPLED_0603_NOOUTLINE]
C7-20  COLOR  LED0603_NOOUTLINE  [CHIPLED_0603_NOOUTLINE]
C7-21  COLOR  LED0603_NOOUTLINE  [CHIPLED_0603_NOOUTLINE]
C7-22  COLOR  LED0603_NOOUTLINE  [CHIPLED_0603_NOOUTLINE]
C7-23  COLOR  LED0603_NOOUTLINE  [CHIPLED_0603_NOOUTLINE]
C7-24  COLOR  LED0603_NOOUTLINE  [CHIPLED_0603_NOOUTLINE]
C7-25  COLOR  LED0603_NOOUTLINE  [CHIPLED_0603_NOOUTLINE]
C7-26  COLOR  LED0603_NOOUTLINE  [CHIPLED_0603_NOOUTLINE]
C7-27  COLOR  LED0603_NOOUTLINE  [CHIPLED_0603_NOOUTLINE]
C7-28  COLOR  LED0603_NOOUTLINE  [CHIPLED_0603_NOOUTLINE]
C7-29  COLOR  LED0603_NOOUTLINE  [CHIPLED_0603_NOOUTLINE]
C7-30  COLOR  LED0603_NOOUTLINE  [CHIPLED_0603_NOOUTLINE]
C7-31  COLOR  LED0603_NOOUTLINE  [CHIPLED_0603_NOOUTLINE]
C7-32  COLOR  LED0603_NOOUTLINE  [CHIPLED_0603_NOOUTLINE]
C8-17  COLOR  LED0603_NOOUTLINE  [CHIPLED_0603_NOOUTLINE]
C8-18  COLOR  LED0603_NOOUTLINE  [CHIPLED_0603_NOOUTLINE]
C8-19  COLOR  LED0603_NOOUTLINE  [CHIPLED_0603_NOOUTLINE]
C8-20  COLOR  LED0603_NOOUTLINE  [CHIPLED_0603_NOOUTLINE]
C8-21  COLOR  LED0603_NOOUTLINE  [CHIPLED_0603_NOOUTLINE]
C8-22  COLOR  LED0603_NOOUTLINE  [CHIPLED_0603_NOOUTLINE]
C8-23  COLOR  LED0603_NOOUTLINE  [CHIPLED_0603_NOOUTLINE]
C8-24  COLOR  LED0603_NOOUTLINE  [CHIPLED_0603_NOOUTLINE]
C8-25  COLOR  LED0603_NOOUTLINE  [CHIPLED_0603_NOOUTLINE]
C8-26  COLOR  LED0603_NOOUTLINE  [CHIPLED_0603_NOOUTLINE]
C8-27  COLOR  LED0603_NOOUTLINE  [CHIPLED_0603_NOOUTLINE]
C8-28  COLOR  LED0603_NOOUTLINE  [CHIPLED_0603_NOOUTLINE]
C8-29  COLOR  LED0603_NOOUTLINE  [CHIPLED_0603_NOOUTLINE]
C8-30  COLOR  LED0603_NOOUTLINE  [CHIPLED_0603_NOOUTLINE]
C8-31  COLOR  LED0603_NOOUTLINE  [CHIPLED_0603_NOOUTLINE]
C8-32  COLOR  LED0603_NOOUTLINE  [CHIPLED_0603_NOOUTLINE]
C9-17  COLOR  LED0603_NOOUTLINE  [CHIPLED_0603_NOOUTLINE]
C9-18  COLOR  LED0603_NOOUTLINE  [CHIPLED_0603_NOOUTLINE]
C9-19  COLOR  LED0603_NOOUTLINE  [CHIPLED_0603_NOOUTLINE]
C9-20  COLOR  LED0603_NOOUTLINE  [CHIPLED_0603_NOOUTLINE]
C9-21  COLOR  LED0603_NOOUTLINE  [CHIPLED_0603_NOOUTLINE]
C9-22  COLOR  LED0603_NOOUTLINE  [CHIPLED_0603_NOOUTLINE]
C9-23  COLOR  LED0603_NOOUTLINE  [CHIPLED_0603_NOOUTLINE]
C9-24  COLOR  LED0603_NOOUTLINE  [CHIPLED_0603_NOOUTLINE]
C9-25  COLOR  LED0603_NOOUTLINE  [CHIPLED_0603_NOOUTLINE]
C9-26  COLOR  LED0603_NOOUTLINE  [CHIPLED_0603_NOOUTLINE]
C9-27  COLOR  LED0603_NOOUTLINE  [CHIPLED_0603_NOOUTLINE]
C9-28  COLOR  LED0603_NOOUTLINE  [CHIPLED_0603_NOOUTLINE]
C9-29  COLOR  LED0603_NOOUTLINE  [CHIPLED_0603_NOOUTLINE]
C9-30  COLOR  LED0603_NOOUTLINE  [CHIPLED_0603_NOOUTLINE]
C9-31  COLOR  LED0603_NOOUTLINE  [CHIPLED_0603_NOOUTLINE]
C9-32  COLOR  LED0603_NOOUTLINE  [CHIPLED_0603_NOOUTLINE]

### Nets
CA1-2: C1-17.C C1-18.C C1-19.C C1-20.C C1-21.C C1-22.C C1-23.C C1-24.C C2-17.A C3-17.A C4-17.A C5-17.A C6-17.A C7-17.A C8-17.A C9-17.A ; also sheet 3
CA2-2: C1-17.A C2-17.C C2-18.C C2-19.C C2-20.C C2-21.C C2-22.C C2-23.C C2-24.C C3-18.A C4-18.A C5-18.A C6-18.A C7-18.A C8-18.A C9-18.A ; also sheet 3
CA3-2: C1-18.A C2-18.A C3-17.C C3-18.C C3-19.C C3-20.C C3-21.C C3-22.C C3-23.C C3-24.C C4-19.A C5-19.A C6-19.A C7-19.A C8-19.A C9-19.A ; also sheet 3
CA4-2: C1-19.A C2-19.A C3-19.A C4-17.C C4-18.C C4-19.C C4-20.C C4-21.C C4-22.C C4-23.C C4-24.C C5-20.A C6-20.A C7-20.A C8-20.A C9-20.A ; also sheet 3
CA5-2: C1-20.A C2-20.A C3-20.A C4-20.A C5-17.C C5-18.C C5-19.C C5-20.C C5-21.C C5-22.C C5-23.C C5-24.C C6-21.A C7-21.A C8-21.A C9-21.A ; also sheet 3
CA6-2: C1-21.A C2-21.A C3-21.A C4-21.A C5-21.A C6-17.C C6-18.C C6-19.C C6-20.C C6-21.C C6-22.C C6-23.C C6-24.C C7-22.A C8-22.A C9-22.A ; also sheet 3
CA7-2: C1-22.A C2-22.A C3-22.A C4-22.A C5-22.A C6-22.A C7-17.C C7-18.C C7-19.C C7-20.C C7-21.C C7-22.C C7-23.C C7-24.C C8-23.A C9-23.A ; also sheet 3
CA8-2: C1-23.A C2-23.A C3-23.A C4-23.A C5-23.A C6-23.A C7-23.A C8-17.C C8-18.C C8-19.C C8-20.C C8-21.C C8-22.C C8-23.C C8-24.C C9-24.A ; also sheet 3
CA9-2: C1-24.A C2-24.A C3-24.A C4-24.A C5-24.A C6-24.A C7-24.A C8-24.A C9-17.C C9-18.C C9-19.C C9-20.C C9-21.C C9-22.C C9-23.C C9-24.C ; also sheet 3
CB1-2: C1-25.C C1-26.C C1-27.C C1-28.C C1-29.C C1-30.C C1-31.C C1-32.C C2-25.A C3-25.A C4-25.A C5-25.A C6-25.A C7-25.A C8-25.A C9-25.A ; also sheet 3
CB2-2: C1-25.A C2-25.C C2-26.C C2-27.C C2-28.C C2-29.C C2-30.C C2-31.C C2-32.C C3-26.A C4-26.A C5-26.A C6-26.A C7-26.A C8-26.A C9-26.A ; also sheet 3
CB3-2: C1-26.A C2-26.A C3-25.C C3-26.C C3-27.C C3-28.C C3-29.C C3-30.C C3-31.C C3-32.C C4-27.A C5-27.A C6-27.A C7-27.A C8-27.A C9-27.A ; also sheet 3
CB4-2: C1-27.A C2-27.A C3-27.A C4-25.C C4-26.C C4-27.C C4-28.C C4-29.C C4-30.C C4-31.C C4-32.C C5-28.A C6-28.A C7-28.A C8-28.A C9-28.A ; also sheet 3
CB5-2: C1-28.A C2-28.A C3-28.A C4-28.A C5-25.C C5-26.C C5-27.C C5-28.C C5-29.C C5-30.C C5-31.C C5-32.C C6-29.A C7-29.A C8-29.A C9-29.A ; also sheet 3
CB6-2: C1-29.A C2-29.A C3-29.A C4-29.A C5-29.A C6-25.C C6-26.C C6-27.C C6-28.C C6-29.C C6-30.C C6-31.C C6-32.C C7-30.A C8-30.A C9-30.A ; also sheet 3
CB7-2: C1-30.A C2-30.A C3-30.A C4-30.A C5-30.A C6-30.A C7-25.C C7-26.C C7-27.C C7-28.C C7-29.C C7-30.C C7-31.C C7-32.C C8-31.A C9-31.A ; also sheet 3
CB8-2: C1-31.A C2-31.A C3-31.A C4-31.A C5-31.A C6-31.A C7-31.A C8-25.C C8-26.C C8-27.C C8-28.C C8-29.C C8-30.C C8-31.C C8-32.C C9-32.A ; also sheet 3
CB9-2: C1-32.A C2-32.A C3-32.A C4-32.A C5-32.A C6-32.A C7-32.A C8-32.A C9-25.C C9-26.C C9-27.C C9-28.C C9-29.C C9-30.C C9-31.C C9-32.C ; also sheet 3

### Notes on the sheet
- Matrix A
- Matrix B

## Sheet 5 of 9: Matrix Driver 3
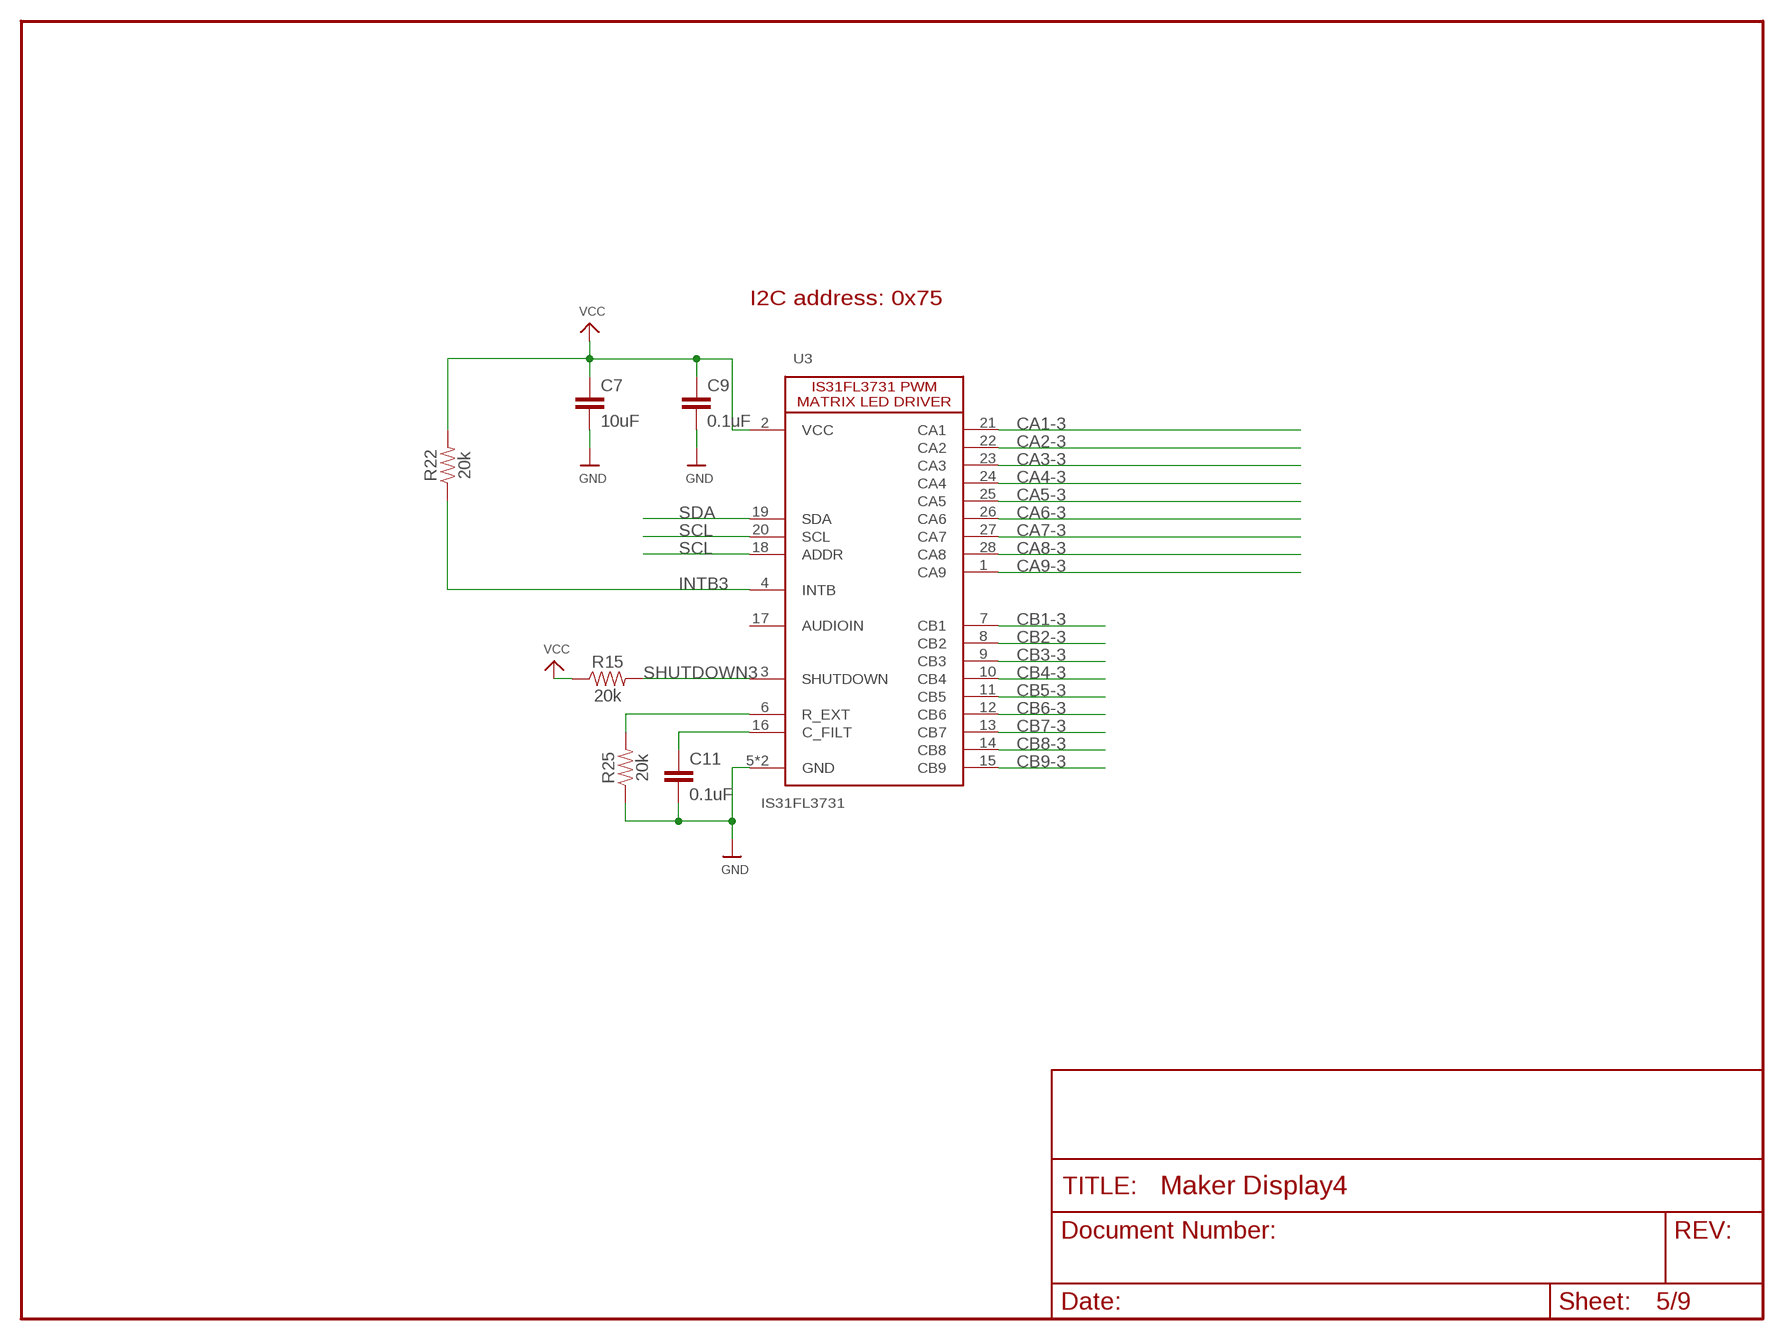
[diagram p4: schematic, sheet 5]

### Parts
C7  10uF  10UF-1206-6.3V-20%  [1206]
C9  0.1uF  0.1UF-0603-25V-(+80/-20%)  [0603]
C11  0.1uF  0.1UF-0603-25V-(+80/-20%)  [0603]
R15  20k  20KOHM-0603-1/10W-1%  [0603]
R22  20k  20KOHM-0603-1/10W-1%  [0603]
R25  20k  20KOHM-0603-1/10W-1%  [0603]
U3  IS31FL3731  [QFN28]

### Nets
CA1-3: U3.21(CA1) ; also sheet 6
CA2-3: U3.22(CA2) ; also sheet 6
CA3-3: U3.23(CA3) ; also sheet 6
CA4-3: U3.24(CA4) ; also sheet 6
CA5-3: U3.25(CA5) ; also sheet 6
CA6-3: U3.26(CA6) ; also sheet 6
CA7-3: U3.27(CA7) ; also sheet 6
CA8-3: U3.28(CA8) ; also sheet 6
CA9-3: U3.1(CA9) ; also sheet 6
CB1-3: U3.7(CB1) ; also sheet 6
CB2-3: U3.8(CB2) ; also sheet 6
CB3-3: U3.9(CB3) ; also sheet 6
CB4-3: U3.10(CB4) ; also sheet 6
CB5-3: U3.11(CB5) ; also sheet 6
CB6-3: U3.12(CB6) ; also sheet 6
CB7-3: U3.13(CB7) ; also sheet 6
CB8-3: U3.14(CB8) ; also sheet 6
CB9-3: U3.15(CB9) ; also sheet 6
GND: C7.2 C9.2 C11.2 R25.1 U3.5(GND) U3.29_GND(GND) ; also sheet 1,3,7,9
INTB3: R22.1 U3.4(INTB)
N$6: C11.1 U3.16(C_FILT)
N$7: R25.2 U3.6(R_EXT)
SCL: U3.18(ADDR) U3.20(SCL) ; also sheet 1,3,7,9
SDA: U3.19(SDA) ; also sheet 1,3,7,9
SHUTDOWN3: R15.2 U3.3(SHUTDOWN)
VCC: C7.1 C9.1 R15.1 R22.2 U3.2(VCC) ; also sheet 1,3,7,9
Unconnected: U3.17(AUDIOIN)

### Notes on the sheet
- I2C address: 0x75

## Sheet 6 of 9: LED matrix 3
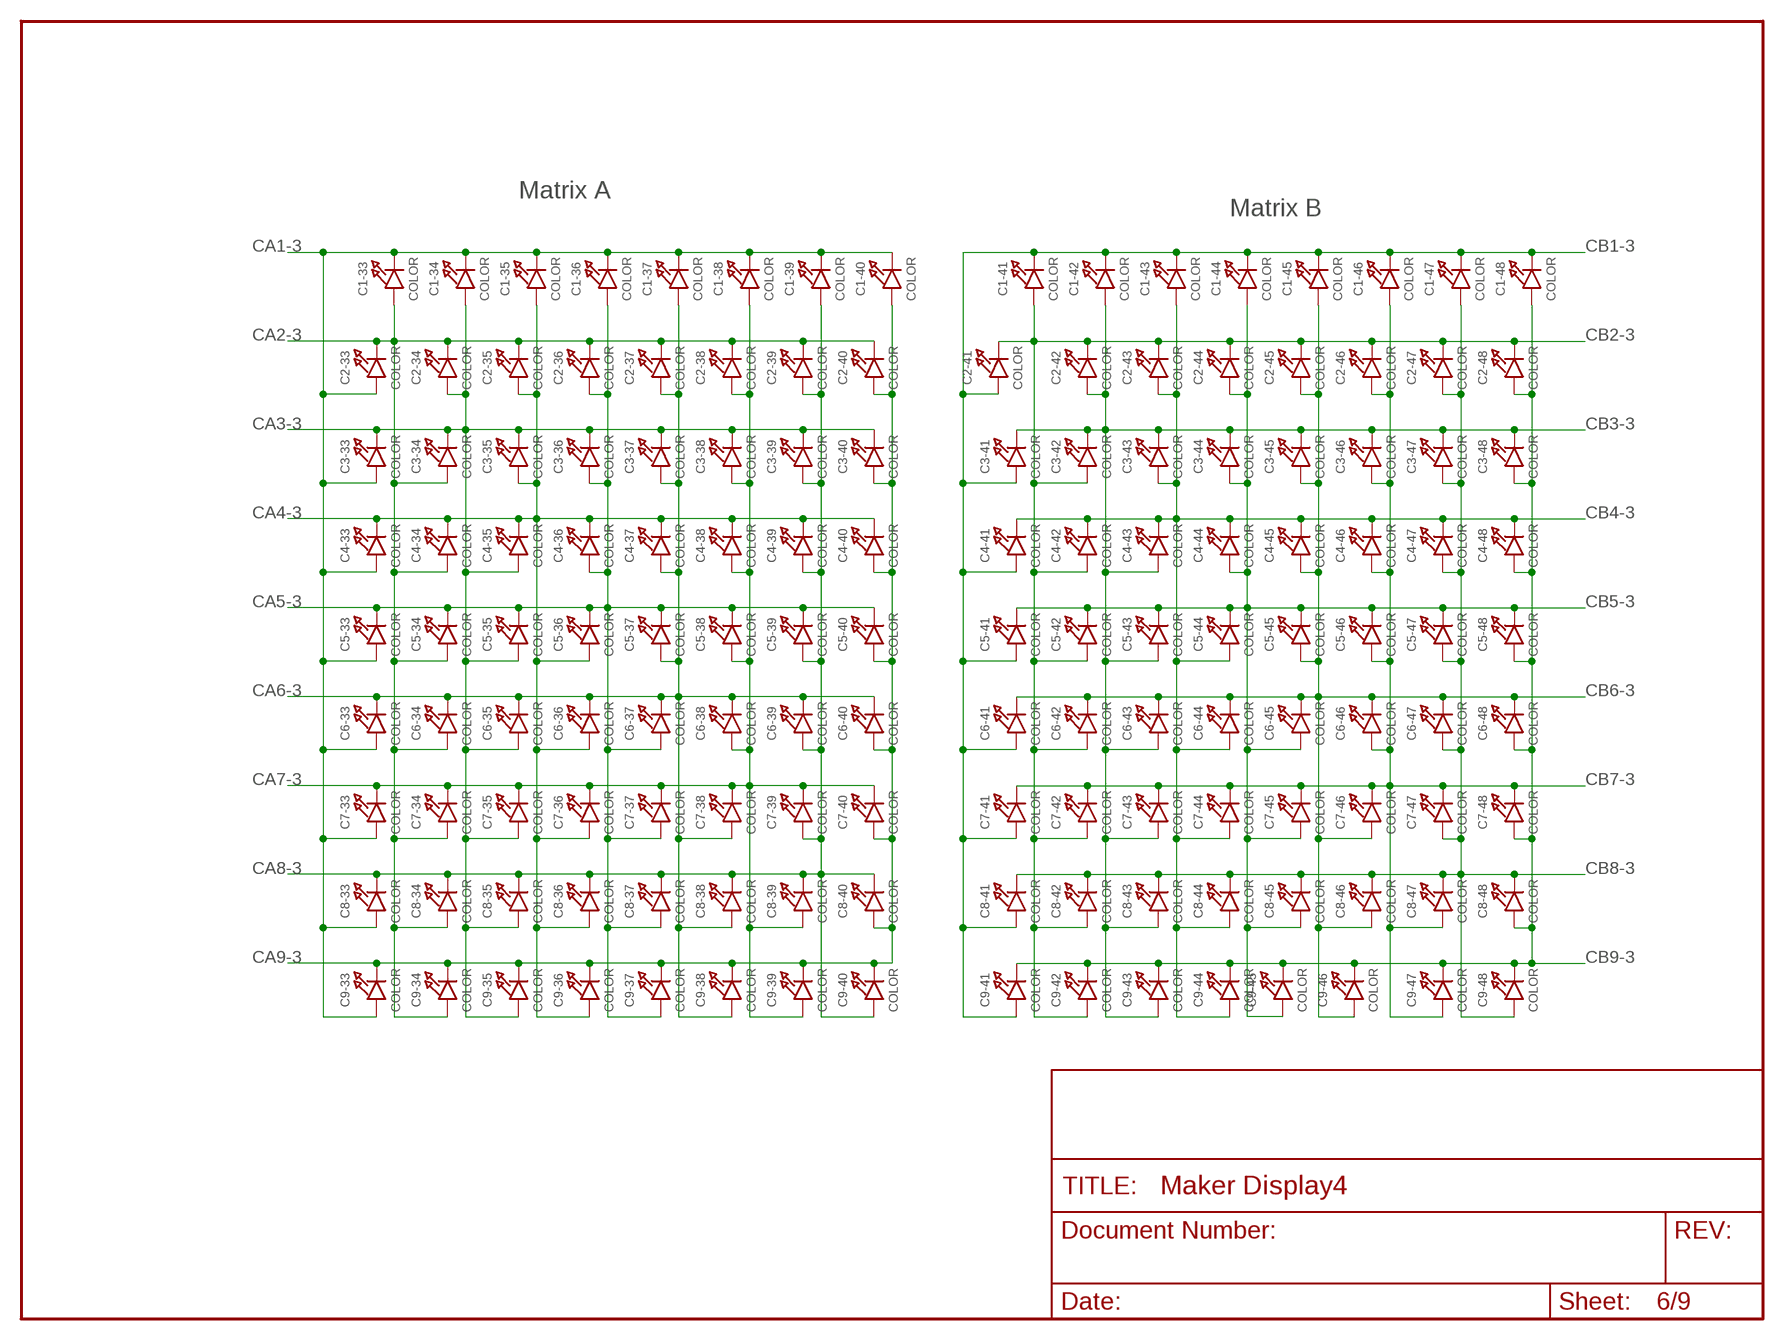
[diagram p5: schematic, sheet 6]

### Parts
C1-33  COLOR  LED0603_NOOUTLINE  [CHIPLED_0603_NOOUTLINE]
C1-34  COLOR  LED0603_NOOUTLINE  [CHIPLED_0603_NOOUTLINE]
C1-35  COLOR  LED0603_NOOUTLINE  [CHIPLED_0603_NOOUTLINE]
C1-36  COLOR  LED0603_NOOUTLINE  [CHIPLED_0603_NOOUTLINE]
C1-37  COLOR  LED0603_NOOUTLINE  [CHIPLED_0603_NOOUTLINE]
C1-38  COLOR  LED0603_NOOUTLINE  [CHIPLED_0603_NOOUTLINE]
C1-39  COLOR  LED0603_NOOUTLINE  [CHIPLED_0603_NOOUTLINE]
C1-40  COLOR  LED0603_NOOUTLINE  [CHIPLED_0603_NOOUTLINE]
C1-41  COLOR  LED0603_NOOUTLINE  [CHIPLED_0603_NOOUTLINE]
C1-42  COLOR  LED0603_NOOUTLINE  [CHIPLED_0603_NOOUTLINE]
C1-43  COLOR  LED0603_NOOUTLINE  [CHIPLED_0603_NOOUTLINE]
C1-44  COLOR  LED0603_NOOUTLINE  [CHIPLED_0603_NOOUTLINE]
C1-45  COLOR  LED0603_NOOUTLINE  [CHIPLED_0603_NOOUTLINE]
C1-46  COLOR  LED0603_NOOUTLINE  [CHIPLED_0603_NOOUTLINE]
C1-47  COLOR  LED0603_NOOUTLINE  [CHIPLED_0603_NOOUTLINE]
C1-48  COLOR  LED0603_NOOUTLINE  [CHIPLED_0603_NOOUTLINE]
C2-33  COLOR  LED0603_NOOUTLINE  [CHIPLED_0603_NOOUTLINE]
C2-34  COLOR  LED0603_NOOUTLINE  [CHIPLED_0603_NOOUTLINE]
C2-35  COLOR  LED0603_NOOUTLINE  [CHIPLED_0603_NOOUTLINE]
C2-36  COLOR  LED0603_NOOUTLINE  [CHIPLED_0603_NOOUTLINE]
C2-37  COLOR  LED0603_NOOUTLINE  [CHIPLED_0603_NOOUTLINE]
C2-38  COLOR  LED0603_NOOUTLINE  [CHIPLED_0603_NOOUTLINE]
C2-39  COLOR  LED0603_NOOUTLINE  [CHIPLED_0603_NOOUTLINE]
C2-40  COLOR  LED0603_NOOUTLINE  [CHIPLED_0603_NOOUTLINE]
C2-41  COLOR  LED0603_NOOUTLINE  [CHIPLED_0603_NOOUTLINE]
C2-42  COLOR  LED0603_NOOUTLINE  [CHIPLED_0603_NOOUTLINE]
C2-43  COLOR  LED0603_NOOUTLINE  [CHIPLED_0603_NOOUTLINE]
C2-44  COLOR  LED0603_NOOUTLINE  [CHIPLED_0603_NOOUTLINE]
C2-45  COLOR  LED0603_NOOUTLINE  [CHIPLED_0603_NOOUTLINE]
C2-46  COLOR  LED0603_NOOUTLINE  [CHIPLED_0603_NOOUTLINE]
C2-47  COLOR  LED0603_NOOUTLINE  [CHIPLED_0603_NOOUTLINE]
C2-48  COLOR  LED0603_NOOUTLINE  [CHIPLED_0603_NOOUTLINE]
C3-33  COLOR  LED0603_NOOUTLINE  [CHIPLED_0603_NOOUTLINE]
C3-34  COLOR  LED0603_NOOUTLINE  [CHIPLED_0603_NOOUTLINE]
C3-35  COLOR  LED0603_NOOUTLINE  [CHIPLED_0603_NOOUTLINE]
C3-36  COLOR  LED0603_NOOUTLINE  [CHIPLED_0603_NOOUTLINE]
C3-37  COLOR  LED0603_NOOUTLINE  [CHIPLED_0603_NOOUTLINE]
C3-38  COLOR  LED0603_NOOUTLINE  [CHIPLED_0603_NOOUTLINE]
C3-39  COLOR  LED0603_NOOUTLINE  [CHIPLED_0603_NOOUTLINE]
C3-40  COLOR  LED0603_NOOUTLINE  [CHIPLED_0603_NOOUTLINE]
C3-41  COLOR  LED0603_NOOUTLINE  [CHIPLED_0603_NOOUTLINE]
C3-42  COLOR  LED0603_NOOUTLINE  [CHIPLED_0603_NOOUTLINE]
C3-43  COLOR  LED0603_NOOUTLINE  [CHIPLED_0603_NOOUTLINE]
C3-44  COLOR  LED0603_NOOUTLINE  [CHIPLED_0603_NOOUTLINE]
C3-45  COLOR  LED0603_NOOUTLINE  [CHIPLED_0603_NOOUTLINE]
C3-46  COLOR  LED0603_NOOUTLINE  [CHIPLED_0603_NOOUTLINE]
C3-47  COLOR  LED0603_NOOUTLINE  [CHIPLED_0603_NOOUTLINE]
C3-48  COLOR  LED0603_NOOUTLINE  [CHIPLED_0603_NOOUTLINE]
C4-33  COLOR  LED0603_NOOUTLINE  [CHIPLED_0603_NOOUTLINE]
C4-34  COLOR  LED0603_NOOUTLINE  [CHIPLED_0603_NOOUTLINE]
C4-35  COLOR  LED0603_NOOUTLINE  [CHIPLED_0603_NOOUTLINE]
C4-36  COLOR  LED0603_NOOUTLINE  [CHIPLED_0603_NOOUTLINE]
C4-37  COLOR  LED0603_NOOUTLINE  [CHIPLED_0603_NOOUTLINE]
C4-38  COLOR  LED0603_NOOUTLINE  [CHIPLED_0603_NOOUTLINE]
C4-39  COLOR  LED0603_NOOUTLINE  [CHIPLED_0603_NOOUTLINE]
C4-40  COLOR  LED0603_NOOUTLINE  [CHIPLED_0603_NOOUTLINE]
C4-41  COLOR  LED0603_NOOUTLINE  [CHIPLED_0603_NOOUTLINE]
C4-42  COLOR  LED0603_NOOUTLINE  [CHIPLED_0603_NOOUTLINE]
C4-43  COLOR  LED0603_NOOUTLINE  [CHIPLED_0603_NOOUTLINE]
C4-44  COLOR  LED0603_NOOUTLINE  [CHIPLED_0603_NOOUTLINE]
C4-45  COLOR  LED0603_NOOUTLINE  [CHIPLED_0603_NOOUTLINE]
C4-46  COLOR  LED0603_NOOUTLINE  [CHIPLED_0603_NOOUTLINE]
C4-47  COLOR  LED0603_NOOUTLINE  [CHIPLED_0603_NOOUTLINE]
C4-48  COLOR  LED0603_NOOUTLINE  [CHIPLED_0603_NOOUTLINE]
C5-33  COLOR  LED0603_NOOUTLINE  [CHIPLED_0603_NOOUTLINE]
C5-34  COLOR  LED0603_NOOUTLINE  [CHIPLED_0603_NOOUTLINE]
C5-35  COLOR  LED0603_NOOUTLINE  [CHIPLED_0603_NOOUTLINE]
C5-36  COLOR  LED0603_NOOUTLINE  [CHIPLED_0603_NOOUTLINE]
C5-37  COLOR  LED0603_NOOUTLINE  [CHIPLED_0603_NOOUTLINE]
C5-38  COLOR  LED0603_NOOUTLINE  [CHIPLED_0603_NOOUTLINE]
C5-39  COLOR  LED0603_NOOUTLINE  [CHIPLED_0603_NOOUTLINE]
C5-40  COLOR  LED0603_NOOUTLINE  [CHIPLED_0603_NOOUTLINE]
C5-41  COLOR  LED0603_NOOUTLINE  [CHIPLED_0603_NOOUTLINE]
C5-42  COLOR  LED0603_NOOUTLINE  [CHIPLED_0603_NOOUTLINE]
C5-43  COLOR  LED0603_NOOUTLINE  [CHIPLED_0603_NOOUTLINE]
C5-44  COLOR  LED0603_NOOUTLINE  [CHIPLED_0603_NOOUTLINE]
C5-45  COLOR  LED0603_NOOUTLINE  [CHIPLED_0603_NOOUTLINE]
C5-46  COLOR  LED0603_NOOUTLINE  [CHIPLED_0603_NOOUTLINE]
C5-47  COLOR  LED0603_NOOUTLINE  [CHIPLED_0603_NOOUTLINE]
C5-48  COLOR  LED0603_NOOUTLINE  [CHIPLED_0603_NOOUTLINE]
C6-33  COLOR  LED0603_NOOUTLINE  [CHIPLED_0603_NOOUTLINE]
C6-34  COLOR  LED0603_NOOUTLINE  [CHIPLED_0603_NOOUTLINE]
C6-35  COLOR  LED0603_NOOUTLINE  [CHIPLED_0603_NOOUTLINE]
C6-36  COLOR  LED0603_NOOUTLINE  [CHIPLED_0603_NOOUTLINE]
C6-37  COLOR  LED0603_NOOUTLINE  [CHIPLED_0603_NOOUTLINE]
C6-38  COLOR  LED0603_NOOUTLINE  [CHIPLED_0603_NOOUTLINE]
C6-39  COLOR  LED0603_NOOUTLINE  [CHIPLED_0603_NOOUTLINE]
C6-40  COLOR  LED0603_NOOUTLINE  [CHIPLED_0603_NOOUTLINE]
C6-41  COLOR  LED0603_NOOUTLINE  [CHIPLED_0603_NOOUTLINE]
C6-42  COLOR  LED0603_NOOUTLINE  [CHIPLED_0603_NOOUTLINE]
C6-43  COLOR  LED0603_NOOUTLINE  [CHIPLED_0603_NOOUTLINE]
C6-44  COLOR  LED0603_NOOUTLINE  [CHIPLED_0603_NOOUTLINE]
C6-45  COLOR  LED0603_NOOUTLINE  [CHIPLED_0603_NOOUTLINE]
C6-46  COLOR  LED0603_NOOUTLINE  [CHIPLED_0603_NOOUTLINE]
C6-47  COLOR  LED0603_NOOUTLINE  [CHIPLED_0603_NOOUTLINE]
C6-48  COLOR  LED0603_NOOUTLINE  [CHIPLED_0603_NOOUTLINE]
C7-33  COLOR  LED0603_NOOUTLINE  [CHIPLED_0603_NOOUTLINE]
C7-34  COLOR  LED0603_NOOUTLINE  [CHIPLED_0603_NOOUTLINE]
C7-35  COLOR  LED0603_NOOUTLINE  [CHIPLED_0603_NOOUTLINE]
C7-36  COLOR  LED0603_NOOUTLINE  [CHIPLED_0603_NOOUTLINE]
C7-37  COLOR  LED0603_NOOUTLINE  [CHIPLED_0603_NOOUTLINE]
C7-38  COLOR  LED0603_NOOUTLINE  [CHIPLED_0603_NOOUTLINE]
C7-39  COLOR  LED0603_NOOUTLINE  [CHIPLED_0603_NOOUTLINE]
C7-40  COLOR  LED0603_NOOUTLINE  [CHIPLED_0603_NOOUTLINE]
C7-41  COLOR  LED0603_NOOUTLINE  [CHIPLED_0603_NOOUTLINE]
C7-42  COLOR  LED0603_NOOUTLINE  [CHIPLED_0603_NOOUTLINE]
C7-43  COLOR  LED0603_NOOUTLINE  [CHIPLED_0603_NOOUTLINE]
C7-44  COLOR  LED0603_NOOUTLINE  [CHIPLED_0603_NOOUTLINE]
C7-45  COLOR  LED0603_NOOUTLINE  [CHIPLED_0603_NOOUTLINE]
C7-46  COLOR  LED0603_NOOUTLINE  [CHIPLED_0603_NOOUTLINE]
C7-47  COLOR  LED0603_NOOUTLINE  [CHIPLED_0603_NOOUTLINE]
C7-48  COLOR  LED0603_NOOUTLINE  [CHIPLED_0603_NOOUTLINE]
C8-33  COLOR  LED0603_NOOUTLINE  [CHIPLED_0603_NOOUTLINE]
C8-34  COLOR  LED0603_NOOUTLINE  [CHIPLED_0603_NOOUTLINE]
C8-35  COLOR  LED0603_NOOUTLINE  [CHIPLED_0603_NOOUTLINE]
C8-36  COLOR  LED0603_NOOUTLINE  [CHIPLED_0603_NOOUTLINE]
C8-37  COLOR  LED0603_NOOUTLINE  [CHIPLED_0603_NOOUTLINE]
C8-38  COLOR  LED0603_NOOUTLINE  [CHIPLED_0603_NOOUTLINE]
C8-39  COLOR  LED0603_NOOUTLINE  [CHIPLED_0603_NOOUTLINE]
C8-40  COLOR  LED0603_NOOUTLINE  [CHIPLED_0603_NOOUTLINE]
C8-41  COLOR  LED0603_NOOUTLINE  [CHIPLED_0603_NOOUTLINE]
C8-42  COLOR  LED0603_NOOUTLINE  [CHIPLED_0603_NOOUTLINE]
C8-43  COLOR  LED0603_NOOUTLINE  [CHIPLED_0603_NOOUTLINE]
C8-44  COLOR  LED0603_NOOUTLINE  [CHIPLED_0603_NOOUTLINE]
C8-45  COLOR  LED0603_NOOUTLINE  [CHIPLED_0603_NOOUTLINE]
C8-46  COLOR  LED0603_NOOUTLINE  [CHIPLED_0603_NOOUTLINE]
C8-47  COLOR  LED0603_NOOUTLINE  [CHIPLED_0603_NOOUTLINE]
C8-48  COLOR  LED0603_NOOUTLINE  [CHIPLED_0603_NOOUTLINE]
C9-33  COLOR  LED0603_NOOUTLINE  [CHIPLED_0603_NOOUTLINE]
C9-34  COLOR  LED0603_NOOUTLINE  [CHIPLED_0603_NOOUTLINE]
C9-35  COLOR  LED0603_NOOUTLINE  [CHIPLED_0603_NOOUTLINE]
C9-36  COLOR  LED0603_NOOUTLINE  [CHIPLED_0603_NOOUTLINE]
C9-37  COLOR  LED0603_NOOUTLINE  [CHIPLED_0603_NOOUTLINE]
C9-38  COLOR  LED0603_NOOUTLINE  [CHIPLED_0603_NOOUTLINE]
C9-39  COLOR  LED0603_NOOUTLINE  [CHIPLED_0603_NOOUTLINE]
C9-40  COLOR  LED0603_NOOUTLINE  [CHIPLED_0603_NOOUTLINE]
C9-41  COLOR  LED0603_NOOUTLINE  [CHIPLED_0603_NOOUTLINE]
C9-42  COLOR  LED0603_NOOUTLINE  [CHIPLED_0603_NOOUTLINE]
C9-43  COLOR  LED0603_NOOUTLINE  [CHIPLED_0603_NOOUTLINE]
C9-44  COLOR  LED0603_NOOUTLINE  [CHIPLED_0603_NOOUTLINE]
C9-45  COLOR  LED0603_NOOUTLINE  [CHIPLED_0603_NOOUTLINE]
C9-46  COLOR  LED0603_NOOUTLINE  [CHIPLED_0603_NOOUTLINE]
C9-47  COLOR  LED0603_NOOUTLINE  [CHIPLED_0603_NOOUTLINE]
C9-48  COLOR  LED0603_NOOUTLINE  [CHIPLED_0603_NOOUTLINE]

### Nets
CA1-3: C1-33.C C1-34.C C1-35.C C1-36.C C1-37.C C1-38.C C1-39.C C1-40.C C2-33.A C3-33.A C4-33.A C5-33.A C6-33.A C7-33.A C8-33.A C9-33.A ; also sheet 5
CA2-3: C1-33.A C2-33.C C2-34.C C2-35.C C2-36.C C2-37.C C2-38.C C2-39.C C2-40.C C3-34.A C4-34.A C5-34.A C6-34.A C7-34.A C8-34.A C9-34.A ; also sheet 5
CA3-3: C1-34.A C2-34.A C3-33.C C3-34.C C3-35.C C3-36.C C3-37.C C3-38.C C3-39.C C3-40.C C4-35.A C5-35.A C6-35.A C7-35.A C8-35.A C9-35.A ; also sheet 5
CA4-3: C1-35.A C2-35.A C3-35.A C4-33.C C4-34.C C4-35.C C4-36.C C4-37.C C4-38.C C4-39.C C4-40.C C5-36.A C6-36.A C7-36.A C8-36.A C9-36.A ; also sheet 5
CA5-3: C1-36.A C2-36.A C3-36.A C4-36.A C5-33.C C5-34.C C5-35.C C5-36.C C5-37.C C5-38.C C5-39.C C5-40.C C6-37.A C7-37.A C8-37.A C9-37.A ; also sheet 5
CA6-3: C1-37.A C2-37.A C3-37.A C4-37.A C5-37.A C6-33.C C6-34.C C6-35.C C6-36.C C6-37.C C6-38.C C6-39.C C6-40.C C7-38.A C8-38.A C9-38.A ; also sheet 5
CA7-3: C1-38.A C2-38.A C3-38.A C4-38.A C5-38.A C6-38.A C7-33.C C7-34.C C7-35.C C7-36.C C7-37.C C7-38.C C7-39.C C7-40.C C8-39.A C9-39.A ; also sheet 5
CA8-3: C1-39.A C2-39.A C3-39.A C4-39.A C5-39.A C6-39.A C7-39.A C8-33.C C8-34.C C8-35.C C8-36.C C8-37.C C8-38.C C8-39.C C8-40.C C9-40.A ; also sheet 5
CA9-3: C1-40.A C2-40.A C3-40.A C4-40.A C5-40.A C6-40.A C7-40.A C8-40.A C9-33.C C9-34.C C9-35.C C9-36.C C9-37.C C9-38.C C9-39.C C9-40.C ; also sheet 5
CB1-3: C1-41.C C1-42.C C1-43.C C1-44.C C1-45.C C1-46.C C1-47.C C1-48.C C2-41.A C3-41.A C4-41.A C5-41.A C6-41.A C7-41.A C8-41.A C9-41.A ; also sheet 5
CB2-3: C1-41.A C2-41.C C2-42.C C2-43.C C2-44.C C2-45.C C2-46.C C2-47.C C2-48.C C3-42.A C4-42.A C5-42.A C6-42.A C7-42.A C8-42.A C9-42.A ; also sheet 5
CB3-3: C1-42.A C2-42.A C3-41.C C3-42.C C3-43.C C3-44.C C3-45.C C3-46.C C3-47.C C3-48.C C4-43.A C5-43.A C6-43.A C7-43.A C8-43.A C9-43.A ; also sheet 5
CB4-3: C1-43.A C2-43.A C3-43.A C4-41.C C4-42.C C4-43.C C4-44.C C4-45.C C4-46.C C4-47.C C4-48.C C5-44.A C6-44.A C7-44.A C8-44.A C9-44.A ; also sheet 5
CB5-3: C1-44.A C2-44.A C3-44.A C4-44.A C5-41.C C5-42.C C5-43.C C5-44.C C5-45.C C5-46.C C5-47.C C5-48.C C6-45.A C7-45.A C8-45.A C9-45.A ; also sheet 5
CB6-3: C1-45.A C2-45.A C3-45.A C4-45.A C5-45.A C6-41.C C6-42.C C6-43.C C6-44.C C6-45.C C6-46.C C6-47.C C6-48.C C7-46.A C8-46.A C9-46.A ; also sheet 5
CB7-3: C1-46.A C2-46.A C3-46.A C4-46.A C5-46.A C6-46.A C7-41.C C7-42.C C7-43.C C7-44.C C7-45.C C7-46.C C7-47.C C7-48.C C8-47.A C9-47.A ; also sheet 5
CB8-3: C1-47.A C2-47.A C3-47.A C4-47.A C5-47.A C6-47.A C7-47.A C8-41.C C8-42.C C8-43.C C8-44.C C8-45.C C8-46.C C8-47.C C8-48.C C9-48.A ; also sheet 5
CB9-3: C1-48.A C2-48.A C3-48.A C4-48.A C5-48.A C6-48.A C7-48.A C8-48.A C9-41.C C9-42.C C9-43.C C9-44.C C9-45.C C9-46.C C9-47.C C9-48.C ; also sheet 5

### Notes on the sheet
- Matrix A
- Matrix B

## Sheet 7 of 9: Matrix Driver 4
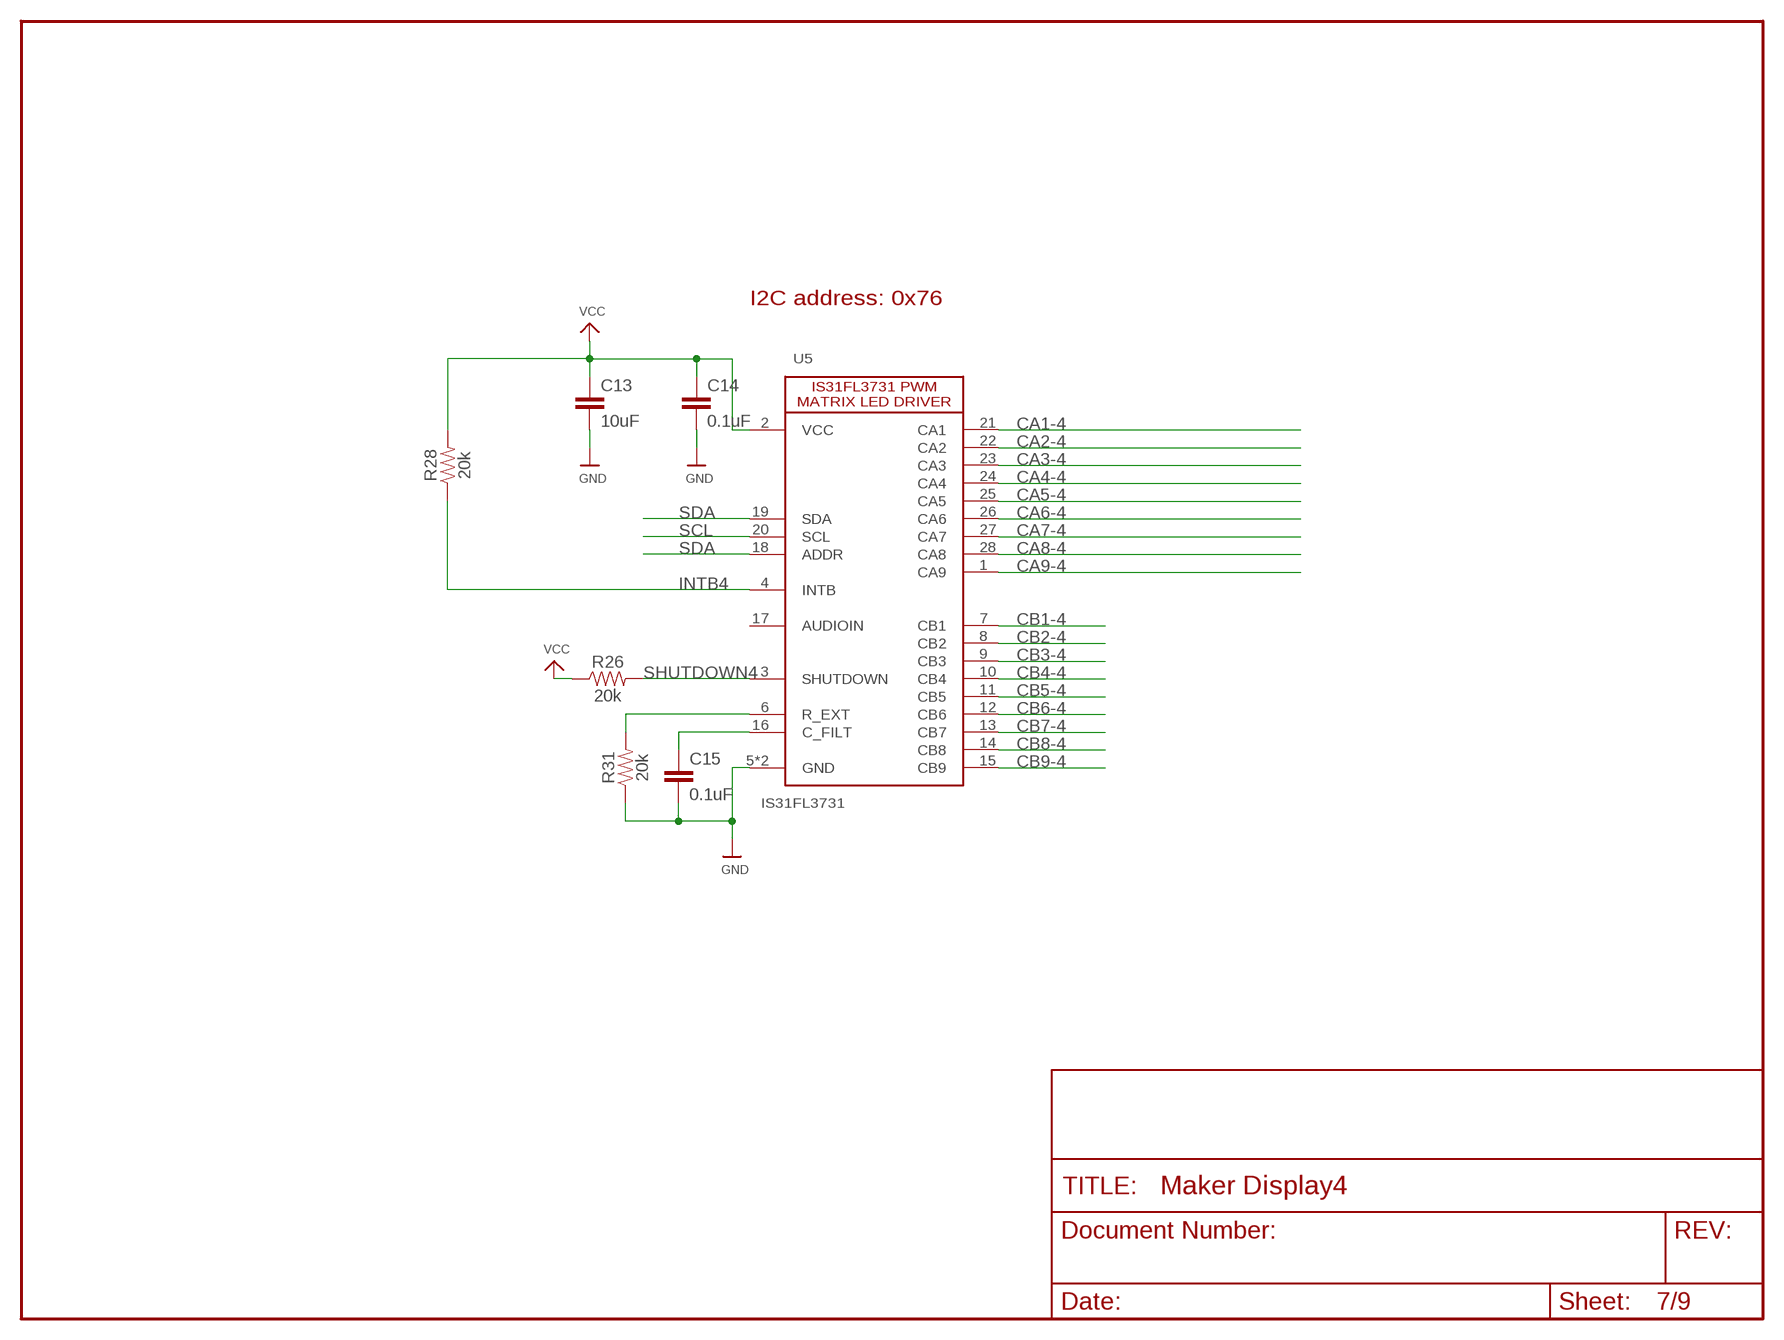
[diagram p6: schematic, sheet 7]

### Parts
C13  10uF  10UF-1206-6.3V-20%  [1206]
C14  0.1uF  0.1UF-0603-25V-(+80/-20%)  [0603]
C15  0.1uF  0.1UF-0603-25V-(+80/-20%)  [0603]
R26  20k  20KOHM-0603-1/10W-1%  [0603]
R28  20k  20KOHM-0603-1/10W-1%  [0603]
R31  20k  20KOHM-0603-1/10W-1%  [0603]
U5  IS31FL3731  [QFN28]

### Nets
CA1-4: U5.21(CA1) ; also sheet 8
CA2-4: U5.22(CA2) ; also sheet 8
CA3-4: U5.23(CA3) ; also sheet 8
CA4-4: U5.24(CA4) ; also sheet 8
CA5-4: U5.25(CA5) ; also sheet 8
CA6-4: U5.26(CA6) ; also sheet 8
CA7-4: U5.27(CA7) ; also sheet 8
CA8-4: U5.28(CA8) ; also sheet 8
CA9-4: U5.1(CA9) ; also sheet 8
CB1-4: U5.7(CB1) ; also sheet 8
CB2-4: U5.8(CB2) ; also sheet 8
CB3-4: U5.9(CB3) ; also sheet 8
CB4-4: U5.10(CB4) ; also sheet 8
CB5-4: U5.11(CB5) ; also sheet 8
CB6-4: U5.12(CB6) ; also sheet 8
CB7-4: U5.13(CB7) ; also sheet 8
CB8-4: U5.14(CB8) ; also sheet 8
CB9-4: U5.15(CB9) ; also sheet 8
GND: C13.2 C14.2 C15.2 R31.1 U5.5(GND) U5.29_GND(GND) ; also sheet 1,3,5,9
INTB4: R28.1 U5.4(INTB)
N$8: C15.1 U5.16(C_FILT)
N$9: R31.2 U5.6(R_EXT)
SCL: U5.20(SCL) ; also sheet 1,3,5,9
SDA: U5.18(ADDR) U5.19(SDA) ; also sheet 1,3,5,9
SHUTDOWN4: R26.2 U5.3(SHUTDOWN)
VCC: C13.1 C14.1 R26.1 R28.2 U5.2(VCC) ; also sheet 1,3,5,9
Unconnected: U5.17(AUDIOIN)

### Notes on the sheet
- I2C address: 0x76